# EAGLE board 3piRB (EAGLE 8.0.2), part 1 of 2
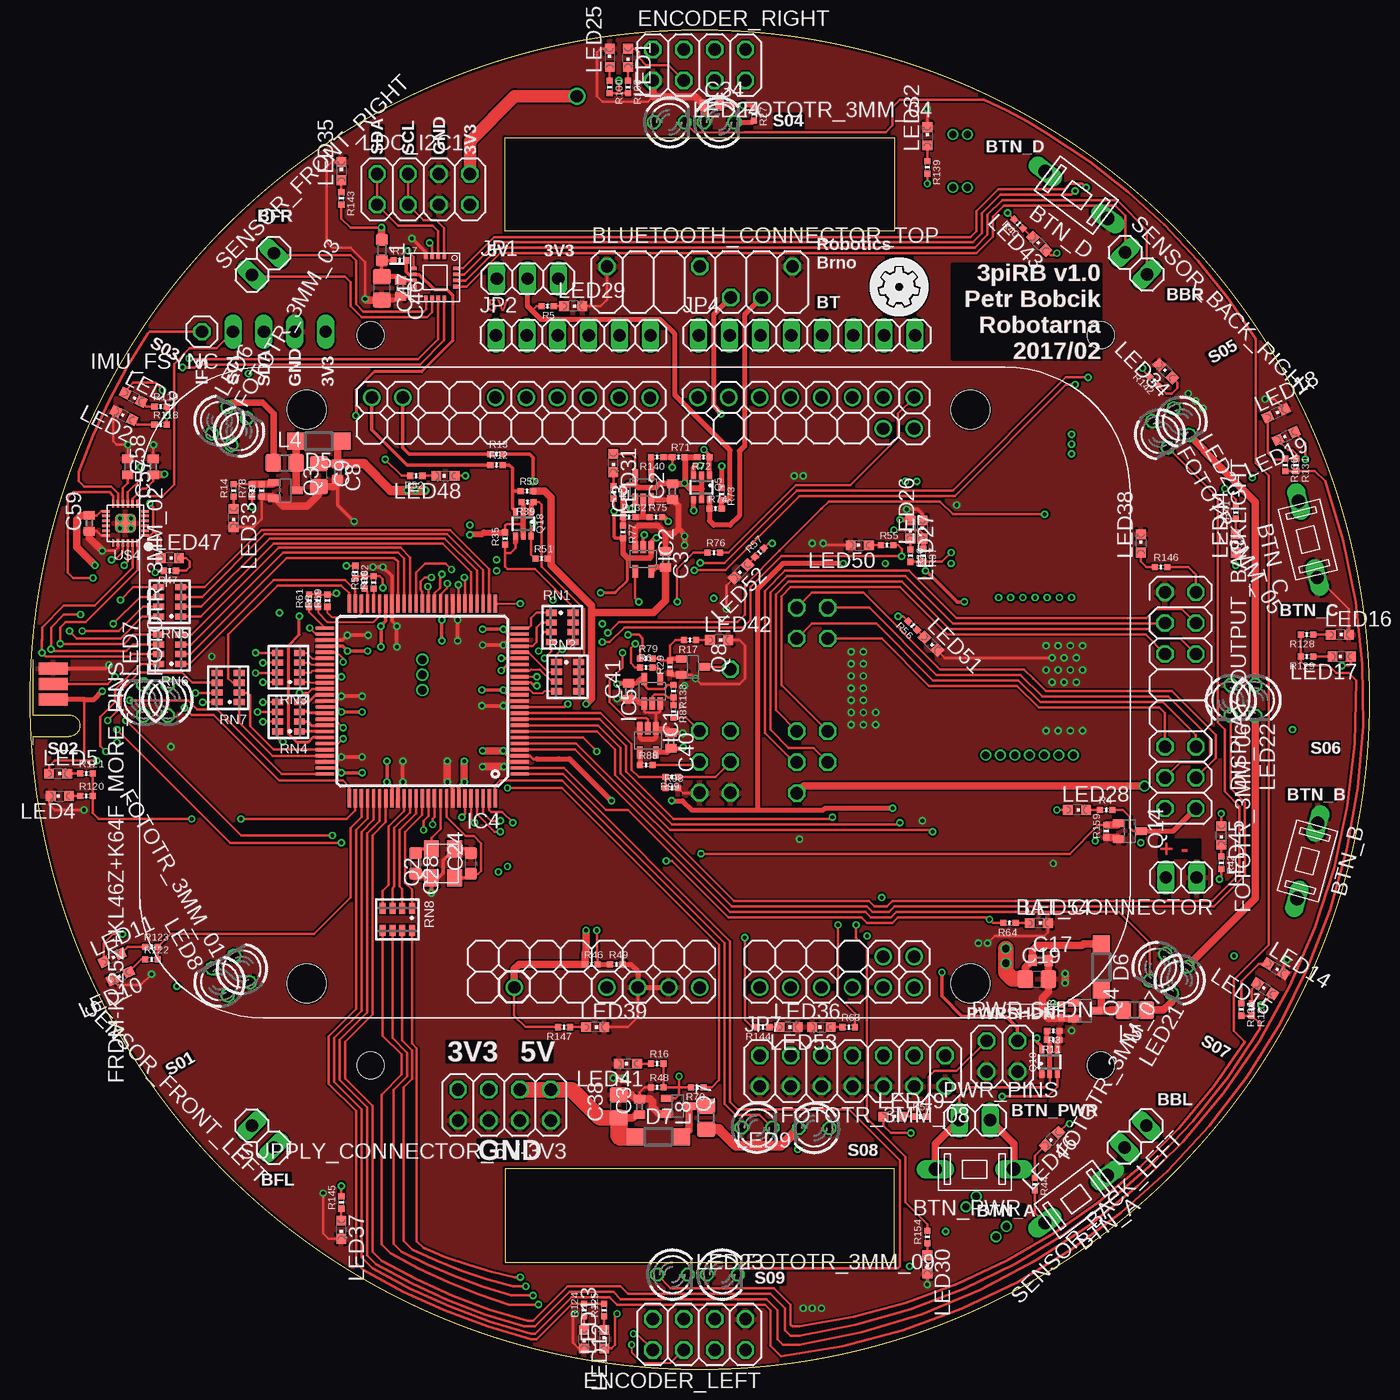
[diagram p13: board, top side]
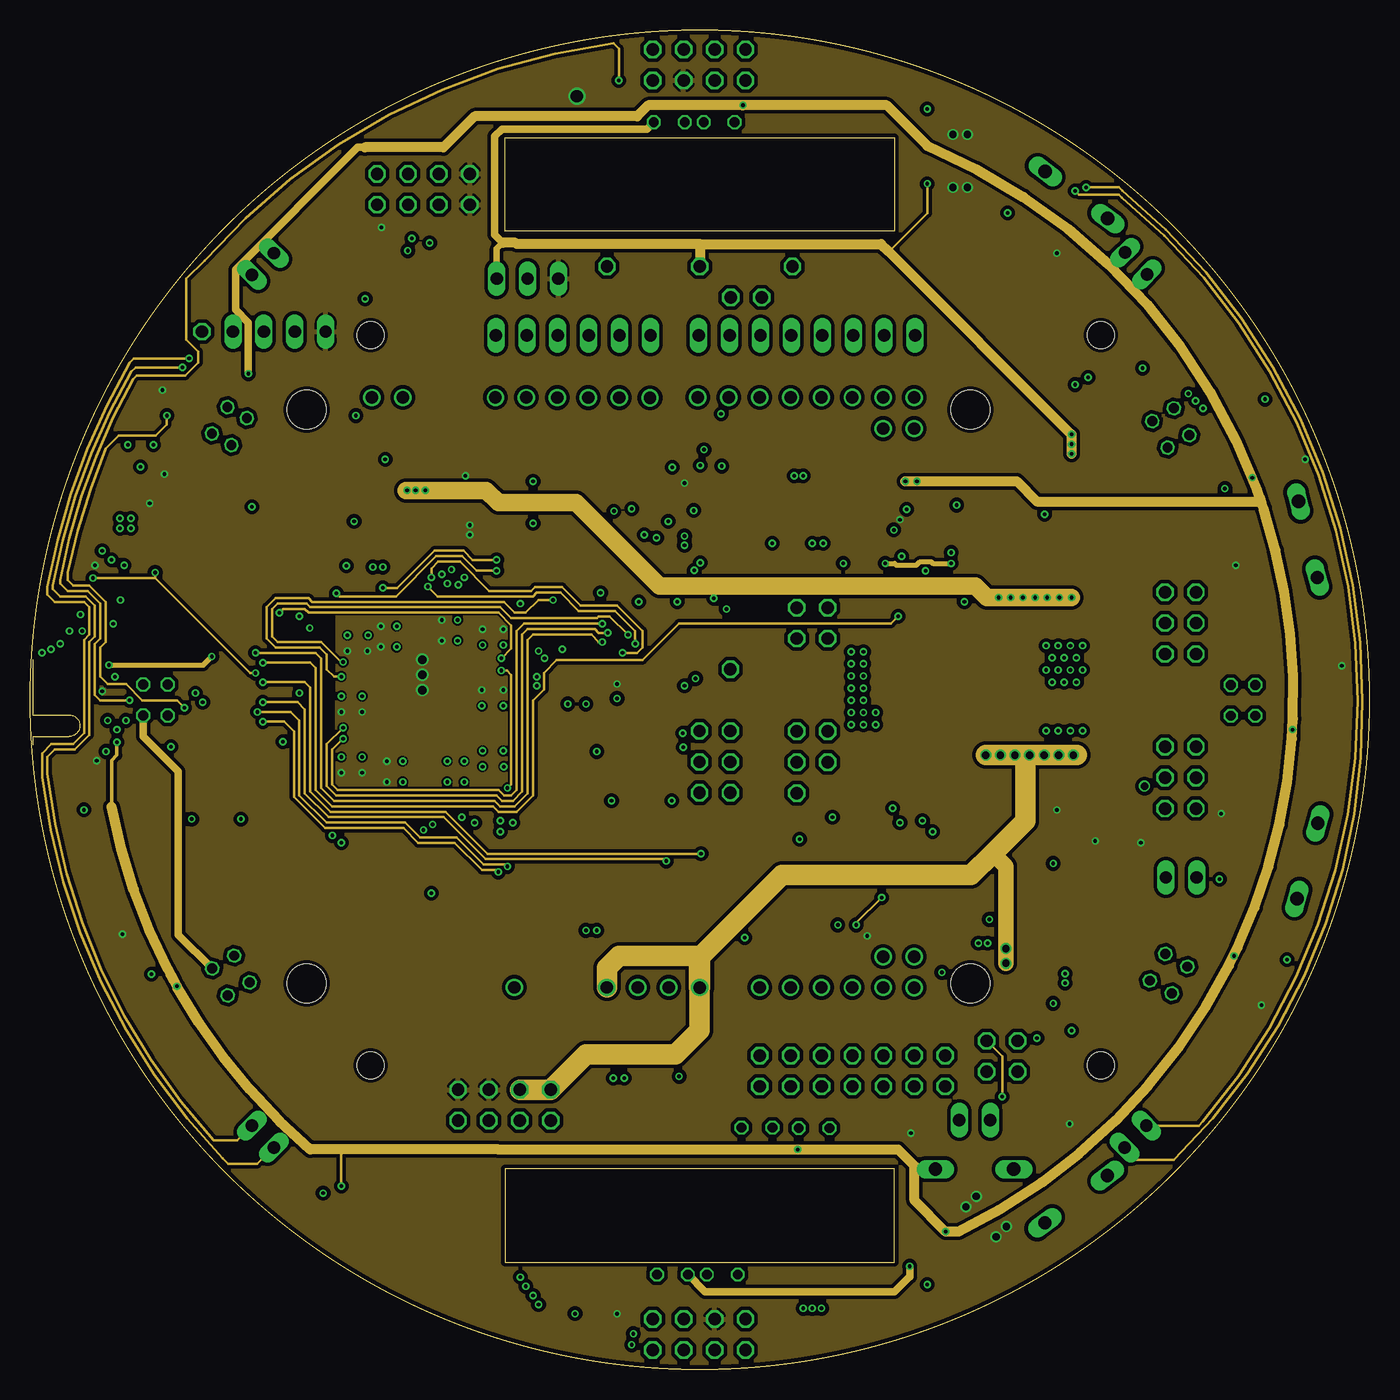
[diagram p14: board, inner layer POWER]
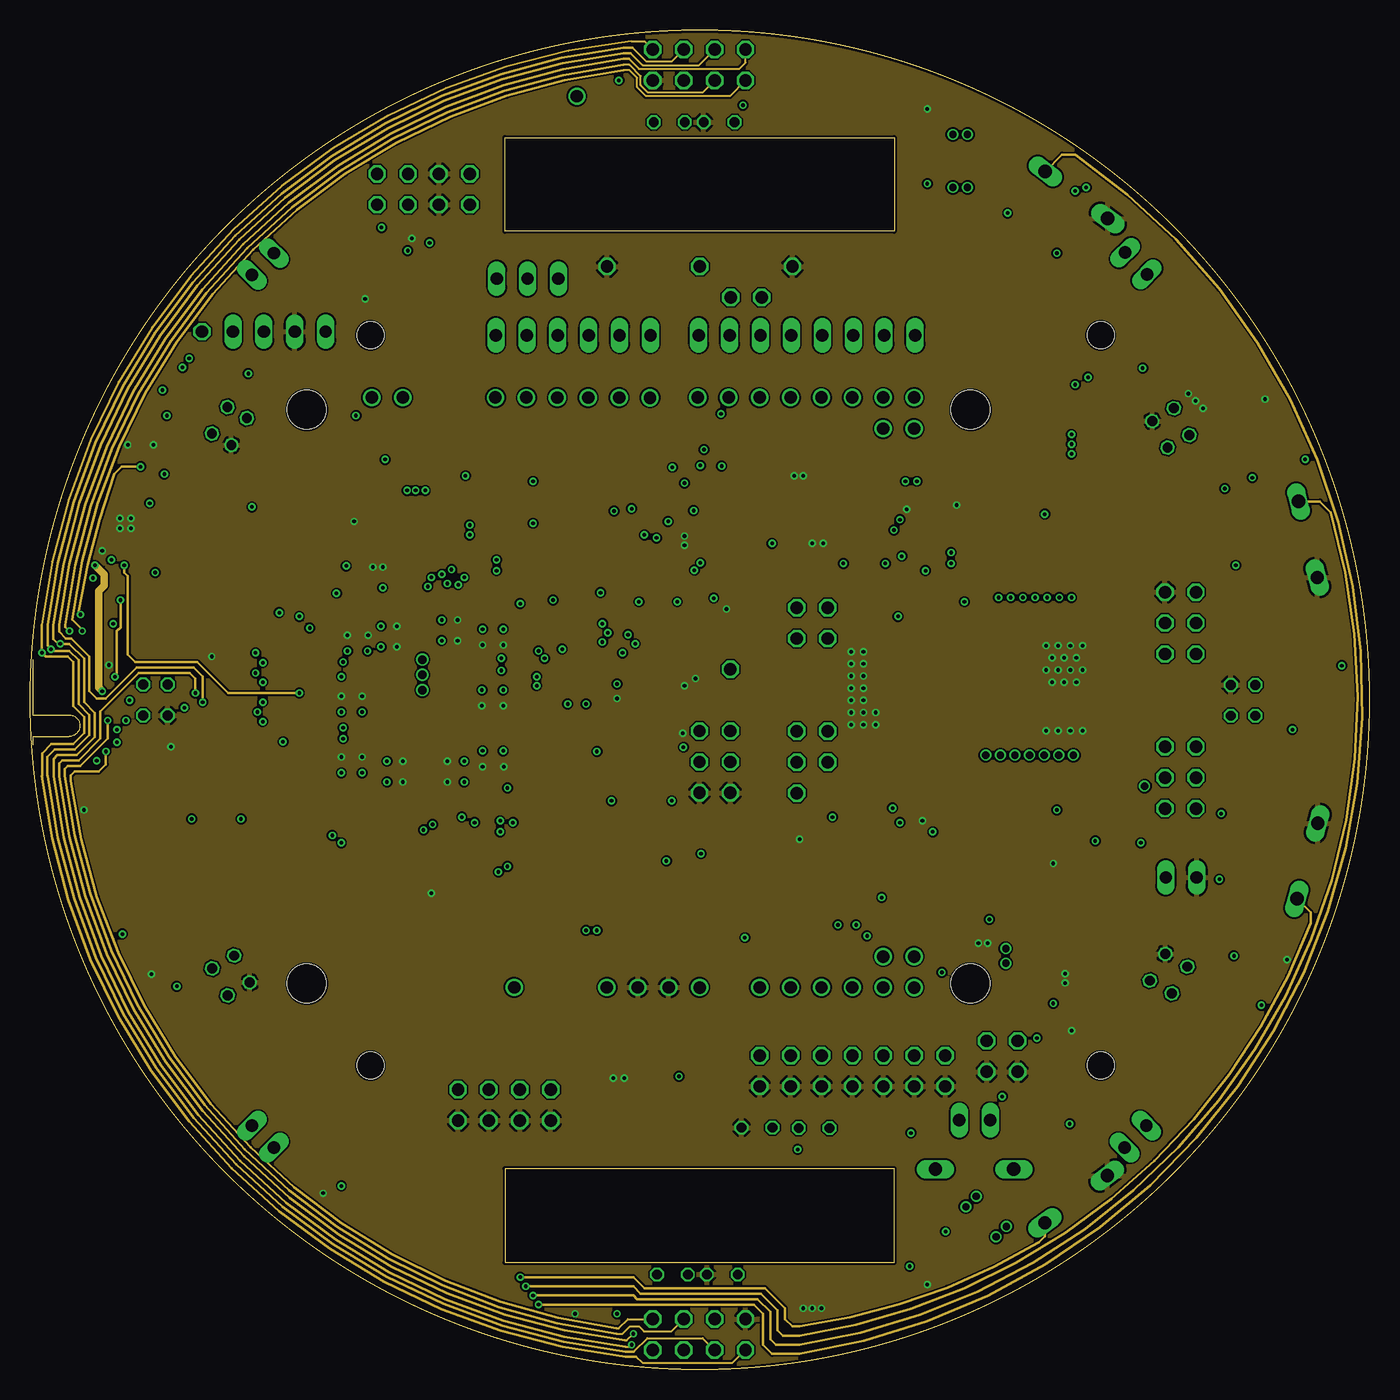
[diagram p15: board, inner layer GND]
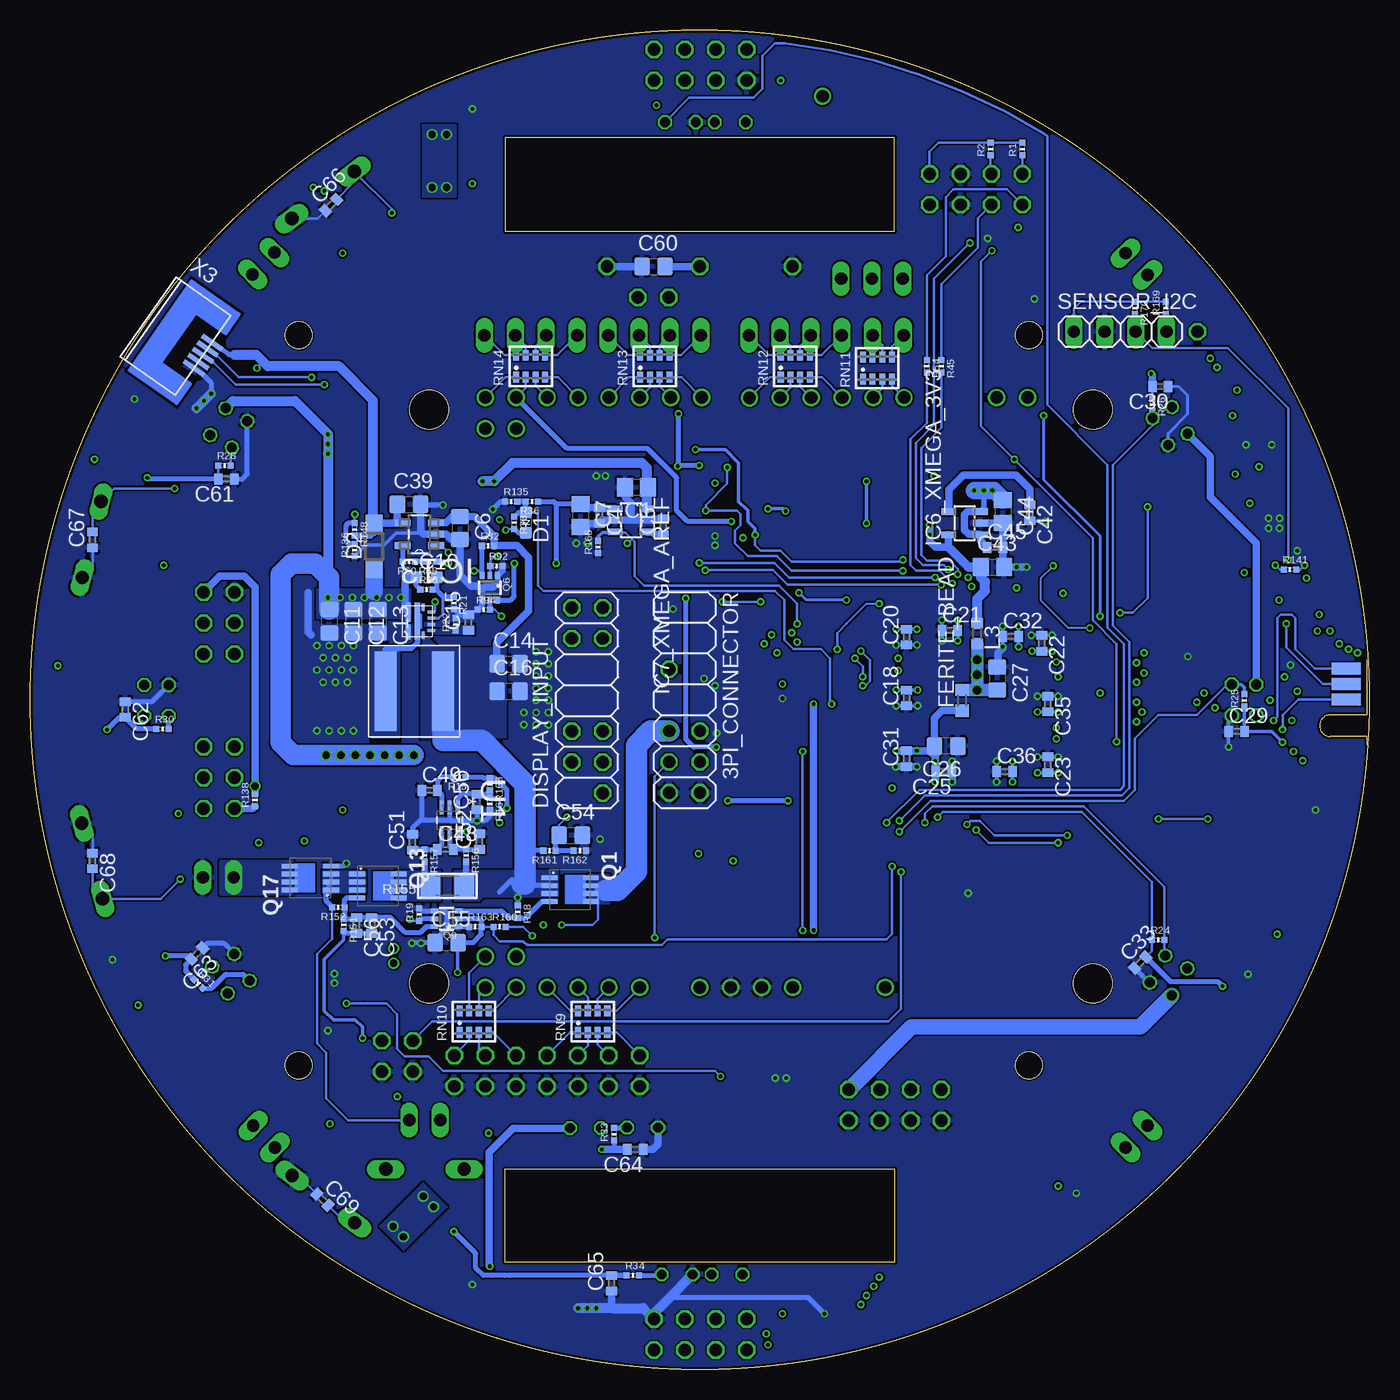
[diagram p16: board, bottom side, seen from below]

Size 110 x 110 mm. Coordinates in mm from the lower left corner, seen from the top.
Outline: 38.99,101.19 70.99,101.19 70.99,93.49 38.99,93.49 38.99,101.19
Outline: 38.99,8.77 70.99,8.77 70.99,16.47 38.99,16.47 38.99,8.77
Outline: circle at 55,55 radius 55
Copper layers (1+2*3+16): Top 0.035mm / dielectric 0.275mm / POWER 0.035mm / dielectric 0.9mm / GND 0.035mm / dielectric 0.275mm / Bot 0.035mm
Design rules "gatema_4_layer": minimum track width 0.15mm, minimum drill 0.3mm, track to track 0.15mm, track to pad 0.15mm, pad to pad 0.15mm, via to via 0.15mm, smd to smd 0mil, copper to edge 0.15mm, drill to drill 0.4mm, minimum pad ring 0.15mm, minimum via ring 0.15mm, stop-mask expansion 0.1mm, vias tented up to drill 0.6mm, thermal gap 0.2mm
Holes 2.2 mm at 27.95,24.95 87.95,24.95 87.95,84.95 27.95,84.95

## Footprints (pad centres in the part's own frame; a part is rotated, then mirrored left to right if it is on the bottom)
3PI_BT_CONNECTOR = drill 1.016 octagon: 6 -2.54,-1.27; 9 2.54,1.27; 10 2.54,-1.27; 11 5.08,1.27; 12 5.08,-1.27; 13 7.62,1.27; 14 7.62,-1.27
1X02 = drill 1.016 long: 1 -1.27,0; 2 1.27,0
BLUETOOTH_CONNECTOR_TOP = drill 1.016 octagon: 2 -7.62,1.27; 8 0,1.27; 9 2.54,-1.27; 11 5.08,-1.27; 14 7.62,1.27
TACTM-35N-F = drill 1.1 long: P$2 3.231,-0.02; P$4 -3.204,-0.02
C0805 = smd 1.3 x 1.5: 1 -0.95,0; 2 0.95,0
C0402 = smd 0.7 x 0.9: 1 -0.65,0; 2 0.65,0
C0603 = smd 1 x 1: 1 -0.85,0; 2 0.85,0
D0603 = smd 1 x 1: A -0.85,0; C 0.85,0
SOD123 = smd 1.4 x 1.4: A 1.9,0; C -1.9,0
DISPLAY_INPUT = drill 1.016 octagon: 2 -7.62,-1.27; 3 -5.08,1.27; 4 -5.08,-1.27; 5 -2.54,1.27; 6 -2.54,-1.27; 11 5.08,1.27; 12 5.08,-1.27; 13 7.62,1.27; 14 7.62,-1.27
PINHEAD_2X8_DISPLAY = drill 1.016 octagon: 1 -8.89,-1.27; 2 -8.89,1.27; 3 -6.35,-1.27; 4 -6.35,1.27; 5 -3.81,-1.27; 6 -3.81,1.27; 11 3.81,-1.27; 12 3.81,1.27; 13 6.35,-1.27; 14 6.35,1.27; 15 8.89,-1.27; 16 8.89,1.27
2X04 = drill 1.016 octagon: 1 -3.81,-1.27; 2 -3.81,1.27; 3 -1.27,-1.27; 4 -1.27,1.27; 5 1.27,-1.27; 6 1.27,1.27; 7 3.81,-1.27; 8 3.81,1.27
R0603 = smd 1 x 1.1: 1 -0.85,0; 2 0.85,0
LED3MM = drill 0.813 octagon: A -1.27,0; K 1.27,0
SOT353 = smd 0.45 x 1: 1 -0.65,-1; 2 0,-1; 3 0.65,-1; 4 0.65,1; 5 -0.65,1
TQFP100 = smd 1.5 x 0.27: 1 -8,6; 2 -8,5.5; 3 -8,5; 4 -8,4.5; 5 -8,4; 6 -8,3.5; 7 -8,3; 8 -8,2.5; 9 -8,2; 10 -8,1.5; 11 -8,1; 12 -8,0.5; 13 -8,0; 14 -8,-0.5; 15 -8,-1; 16 -8,-1.5; 17 -8,-2; 18 -8,-2.5; 19 -8,-3; 20 -8,-3.5; 21 -8,-4; 22 -8,-4.5; 23 -8,-5; 24 -8,-5.5; 25 -8,-6; 51 8,-6; 52 8,-5.5; 53 8,-5; 54 8,-4.5; 55 8,-4; 56 8,-3.5; 57 8,-3; 58 8,-2.5; 59 8,-2; 60 8,-1.5; 61 8,-1; 62 8,-0.5; 63 8,0; 64 8,0.5; 65 8,1; 66 8,1.5; 67 8,2; 68 8,2.5; 69 8,3; 70 8,3.5; 71 8,4; 72 8,4.5; 73 8,5; 74 8,5.5; 75 8,6 | smd 0.27 x 1.5: 26 -6,-8; 27 -5.5,-8; 28 -5,-8; 29 -4.5,-8; 30 -4,-8; 31 -3.5,-8; 32 -3,-8; 33 -2.5,-8; 34 -2,-8; 35 -1.5,-8; 36 -1,-8; 37 -0.5,-8; 38 0,-8; 39 0.5,-8; 40 1,-8; 41 1.5,-8; 42 2,-8; 43 2.5,-8; 44 3,-8; 45 3.5,-8; 46 4,-8; 47 4.5,-8; 48 5,-8; 49 5.5,-8; 50 6,-8; 76 6,8; 77 5.5,8; 78 5,8; 79 4.5,8; 80 4,8; 81 3.5,8; 82 3,8; 83 2.5,8; 84 2,8; 85 1.5,8; 86 1,8; 87 0.5,8; 88 0,8; 89 -0.5,8; 90 -1,8; 91 -1.5,8; 92 -2,8; 93 -2.5,8; 94 -3,8; 95 -3.5,8; 96 -4,8; 97 -4.5,8; 98 -5,8; 99 -5.5,8; 100 -6,8
SOT23-DBV = smd 0.55 x 1.2: 1 -0.95,-1.3; 2 0,-1.3; 3 0.95,-1.3; 4 0.95,1.3; 5 -0.95,1.3
SOT95P300X145-5N = smd 1.321 x 0.559: 1 -1.372,0.94; 2 -1.372,0; 3 -1.372,-0.94; 4 1.372,-0.94; 5 1.372,0.94
1X01 = drill 1.016 octagon: 1 0,0
1X03 = drill 1.016 long: 1 -2.54,0; 2 0,0; 3 2.54,0
1X06 = drill 1.016 long: 1 -6.35,0; 2 -3.81,0; 3 -1.27,0; 4 1.27,0; 5 3.81,0; 6 6.35,0
SMD-6 = smd 2.4 x 1: P$1 1.7,-0.03; P$3 1.7,-1.3; P$5 1.7,-2.57 | smd 2.4 x 1 bottom: P$2 1.7,-0.03; P$4 1.7,-1.3; P$6 1.7,-2.57
1X08 = drill 1.016 long: 1 -8.89,0; 2 -6.35,0; 3 -3.81,0; 4 -1.27,0; 5 1.27,0; 6 3.81,0; 7 6.35,0; 8 8.89,0
2X07 = drill 1.016 octagon: 1 -7.62,-1.27; 2 -7.62,1.27; 3 -5.08,-1.27; 4 -5.08,1.27; 5 -2.54,-1.27; 6 -2.54,1.27; 7 0,-1.27; 8 0,1.27; 9 2.54,-1.27; 10 2.54,1.27; 11 5.08,-1.27; 12 5.08,1.27; 13 7.62,-1.27; 14 7.62,1.27
R0603' = smd 1 x 1: 1 -0.85,0; 2 0.85,0
R0805@1 = smd 1.3 x 1.5: 1 -0.95,0; 2 0.95,0
XAL7030 = smd 1.78 x 6.52: 1 -2.36,0; 2 2.36,0
CHIPLED_0603 = smd 0.8 x 0.8: A 0,-0.75; C 0,0.75
2X02 = drill 1.016 octagon: 1 -1.27,-1.27; 2 -1.27,1.27; 3 1.27,-1.27; 4 1.27,1.27
MLP3.3X3.3_HS = smd 0.4 x 1.3: 1 -0.975,-1.7; 2 -0.325,-1.7; 3 0.325,-1.7; 4 0.975,-1.7; 5 0.975,1.7; 6 0.325,1.7; 7 -0.325,1.7; 8 -0.975,1.7
ABM8 = smd 1.4 x 1.2: GND$1 -1.2,0.95; GND$2 1.2,-0.95; Q$1 -1.2,-0.95; Q$2 1.2,0.95
SOT323 = smd 0.6 x 1: 1 -0.65,-0.9; 2 0.65,-0.9; 3 0,0.9
SOT363 = smd 0.4 x 0.6: 1 -0.65,-1; 2 0,-1; 3 0.65,-1; 4 0.65,1; 5 0,1; 6 -0.65,1
_0402MP = smd 0.5 x 0.5: 1 -0.508,0; 2 0.508,0
1206 = smd 1.6 x 1.8: 1 -1.4,0; 2 1.4,0
742-8 = smd 0.5 x 0.9: 1 -1.2,-0.9; 2 -0.4,-0.9; 3 0.4,-0.9; 4 1.2,-0.9; 5 1.2,0.9; 6 0.4,0.9; 7 -0.4,0.9; 8 -1.2,0.9
1X04 = drill 1.016 long: 1 -3.81,0; 2 -1.27,0; 3 1.27,0; 4 3.81,0
SOT65P210X110-6N = smd 1.168 x 0.356: 1 -1.041,0.66; 2 -1.041,0; 3 -1.041,-0.66; 4 1.041,-0.66; 5 1.041,0; 6 1.041,0.66
VQFN = smd 1.24 x 0.44: 1 -0.9,0.77 | smd 3.04 x 0.44: 2 0,0 | smd 0.6 x 0.25: 3 -1.15,-0.475; 8 1.15,-0.475 | smd 0.25 x 0.6: 4 -0.75,-1.15; 5 -0.25,-1.15; 6 0.25,-1.15; 7 0.75,-1.15 | smd 1.59 x 0.44: 9 0.725,0.77
FRDM-KL25Z+KL46Z+K64F_MORE_PINS = drill 1.016: J1_1 -22.334,21.662; J1_2 -24.885,21.67; J1_3 -22.334,19.122; J1_4 -24.89,19.13; J1_6 -24.89,16.59; J1_8 -24.89,14.05; J1_10 -24.89,11.51; J1_12 -24.89,8.97; J1_14 -24.89,6.43; J1_16 -24.89,3.89; J2_2 -24.87,-0.035; J2_4 -24.875,-2.575; J2_6 -24.88,-5.115; J2_8 -24.88,-7.655; J2_10 -24.885,-10.195; J2_12 -24.885,-12.735; J2_18 -24.885,-20.355; J2_20 -24.885,-22.895; J3_4 23.587,-11.2; J3_10 23.587,-3.58; J3_12 23.59,-1.04; J3_14 23.587,1.5; J3_16 23.592,4.04; J4_2 23.59,8.97; J4_4 23.59,11.51; J4_6 23.59,14.05; J4_8 23.59,16.59; J4_9 21.05,19.13; J4_10 23.59,19.13; J4_11 21.055,21.665; J4_12 23.595,21.67 | hole 3.2: -23.885,26.295; 23.265,26.295; 23.265,-28.245; -23.885,-28.245
LDC1614-WQFN = smd 0.5 x 0.3: 1 0.25,2.75; 2 0.25,2.25; 3 0.25,1.75; 4 0.25,1.25; 9 3.75,1.25; 10 3.75,1.75; 11 3.75,2.25; 12 3.75,2.75 | smd 0.3 x 0.5: 5 1.25,0.25; 6 1.75,0.25; 7 2.25,0.25; 8 2.75,0.25; 13 2.75,3.75; 14 2.25,3.75; 15 1.75,3.75; 16 1.25,3.75
LEAD-QFN24 = smd 0.6 x 0.2: 1 -1.6,1; 2 -1.6,0.6; 3 -1.6,0.2; 4 -1.6,-0.2; 5 -1.6,-0.6; 6 -1.6,-1; 13 1.6,-1; 14 1.6,-0.6; 15 1.6,-0.2; 16 1.6,0.2; 17 1.6,0.6; 18 1.6,1 | smd 0.2 x 0.6: 7 -1,-1.6; 8 -0.6,-1.6; 9 -0.2,-1.6; 10 0.2,-1.6; 11 0.6,-1.6; 12 1,-1.6; 19 1,1.6; 20 0.6,1.6; 21 0.2,1.6; 22 -0.2,1.6; 23 -0.6,1.6; 24 -1,1.6 | smd 1.7 x 1.54: 25 0,0
USB-MICRO-B-BOTTOM-MOLEX = smd 2 x 0.4: 1 5,1.3; 2 5,0.65; 3 5,0; 4 5,-0.65; 5 5,-1.3

## Placement (x,y rotation side)
3PI_CONNECTOR  3PI_CONNECTOR  [3PI_BT_CONNECTOR]  56.25,54.97 270 bottom
BAT_CONNECTOR  BATTERY_LI-POL  [1X02]  94.57,40.4 180 top
BLUETOOTH_CONNECTOR_TOP  [BLUETOOTH_CONNECTOR_TOP]  55,89.33 0 top
BTN_A  TACTM-35N-F  [TACTM-35N-F]  85.95,13.95 217 top
BTN_B  TACTM-35N-F  [TACTM-35N-F]  104.95,41.75 254.5 top
BTN_C  TACTM-35N-F  [TACTM-35N-F]  104.95,68.15 104 top
BTN_D  TACTM-35N-F  [TACTM-35N-F]  85.95,96.45 143 top
BTN_PWR  TACTM-35N-F  [TACTM-35N-F]  77.6,16.4 180 top
C1  10u/16V  [C0805]  60.2,72.45 180 bottom
C2  100n/16V  [C0402]  52.75,72.1 90 top
C3  100n/16V  [C0402]  52.2,66.55 270 top
C4  100n/16V  [C0402]  63.24,70.14 270 bottom
C5  10n/16V  [C0402]  58,69.2 90 bottom
C6  10u/16V  [C0805]  74.7,69.1 270 bottom
C7  10u/16V  [C0805]  64.79,70.14 270 bottom
C8  100n/16V  [C0402]  25.25,73.75 270 top
C9  10u/16V  [C0805]  23.7,73.45 270 top
C10  10p/16V  [C0603]  77.45,65.05 0 bottom
C11  22u/16V  [C0805]  85.45,61.45 270 bottom
C12  22u/16V  [C0805]  83.45,61.45 270 bottom
C13  22u/16V  [C0805]  81.45,61.45 270 bottom
C14  10u/16V  [C0805]  70.7,57.95 0 bottom
C15  10n/16V  [C0402]  74,61.35 90 bottom
C16  1u/16V  [C0805]  70.7,55.7 0 bottom
C17  100n/16V  [C0402]  83,33.6 0 top
C18  100n/16V  [C0402]  38,55.15 90 bottom
C19  10u/16V  [C0805]  82.7,32.05 0 top
C20  100n/16V  [C0402]  38,60.15 90 bottom
C21  100n/16V  [C0402]  34.45,60.7 0 bottom
C22  100n/16V  [C0402]  26.9,59.65 270 bottom
C23  100n/16V  [C0402]  26.4,49.65 270 bottom
C24  10p/16V  [C0603]  36.2,41.55 90 top
C25  100n/16V  [C0402]  34.95,49.1 180 bottom
C26  10u/16V  [C0805]  34.75,51.2 180 bottom
C27  10u/16V  [C0805]  30.55,56.75 270 bottom
C28  10p/16V  [C0603]  31.65,41.55 270 top
C29  100n/16V  [C0402]  10.9,52.4 0 bottom
C30  100n/16V  [C0402]  17.15,80.75 180 bottom
C31  100n/16V  [C0402]  38,50.15 90 bottom
C32  100n/16V  [C0402]  29.45,60.2 0 bottom
C33  100n/16V  [C0402]  18.8,33.4 45 bottom
C34  100n/16V  [C0402]  56,103.85 0 top
C35  100n/16V  [C0402]  26.4,54.65 270 bottom
C36  100n/16V  [C0402]  29.95,49.1 0 bottom
C37  100n/16V  [C0402]  50.05,21.55 90 top
C38  10u/16V  [C0805]  48.35,21.6 90 top
C39  10u/16V  [C0805]  78.9,71.05 0 bottom
C40  100n/16V  [C0402]  52.64,51.66 270 top
C41  100n/16V  [C0402]  49.15,55.7 90 top
C42  10n/16V  [C0402]  27.89,70.36 270 bottom
C43  10u/16V  [C0805]  30.94,65.91 0 bottom
C44  10u/16V  [C0805]  30.09,70.46 270 bottom
C45  100n/16V  [C0402]  30.74,67.51 0 bottom
C46  100n/16V  [C0402]  30.4,88.8 270 top
C47  10u/16V  [C0805]  28.88,88.8 270 top
C48  10n/16V  [C0402]  75.9,42.7 0 bottom
C49  100n/16V  [C0402]  77.2,47.55 0 bottom
C50  100n/16V  [C0402]  73.3,46.6 90 bottom
C51  10n/16V  [C0402]  78.6,43.3 90 bottom
C52  10n/16V  [C0402]  73.1,43.35 90 bottom
C53  100n/16V  [C0402]  81.95,36.45 270 bottom
C54  1u/16V  [C0805]  65.6,43.85 0 bottom
C55  10u/16V  [C0805]  75.8,35.05 0 bottom
C56  100n/16V  [C0402]  83.2,36.45 270 bottom
C57  100n/16V  [C0402]  8,74.15 270 top
C58  100n/16V  [C0402]  10.1,74.15 90 top
C59  100n/16V  [C0402]  4.85,69.5 90 top
C60  10u/16V  [C0805]  58.8,90.6 0 bottom
C61  100n/16V  [C0402]  93.9,73.15 180 bottom
C62  100n/16V  [C0402]  102.2,54.2 270 bottom
C63  100n/16V  [C0402]  96.31,34.14 225 bottom
C64  100n/16V  [C0402]  60.3,18.05 180 bottom
C65  100n/16V  [C0402]  62.25,7.05 90 bottom
C66  100n/16V  [C0402]  85.29,95.64 45 bottom
C67  100n/16V  [C0402]  104.9,68.15 90 bottom
C68  100n/16V  [C0402]  104.9,41.75 270 bottom
C69  100n/16V  [C0402]  86,13.91 315 bottom
D1  [D0603]  69.3,69.55 270 bottom
D2  DB2X41500L  [SOD123]  81.75,67.6 90 bottom
D5  DB2X41500L  [SOD123]  23.7,76.25 180 top
D6  DB2X41500L  [SOD123]  88,33.05 270 top
D7  DB2X41500L  [SOD123]  51.6,19.1 0 top
DISPLAY_INPUT  [DISPLAY_INPUT]  64.25,54.95 90 bottom
DISPLAY_OUTPUT_BACKLIGHT  PINHEAD_2X8_DISPLAY  [PINHEAD_2X8_DISPLAY]  94.5,54.95 270 top
ENCODER_LEFT  [2X04]  54.95,2.84 180 top
ENCODER_RIGHT  [2X04]  54.95,107.16 0 top
FERITE_BEAD  [R0603]  33.45,54.95 90 bottom
FOTOTR_3MM_01  L-93DP3BT  [LED3MM]  17.39,32.87 120 top
FOTOTR_3MM_02  L-93DP3BT  [LED3MM]  11.27,54.98 90 top
FOTOTR_3MM_03  L-93DP3BT  [LED3MM]  17.15,77.04 60 top
FOTOTR_3MM_04  L-93DP3BT  [LED3MM]  56.6,102.45 0 top
FOTOTR_3MM_05  L-93DP3BT  [LED3MM]  92.81,76.81 300 top
FOTOTR_3MM_06  L-93DP3BT  [LED3MM]  98.63,54.96 270 top
FOTOTR_3MM_07  L-93DP3BT  [LED3MM]  92.61,33.02 240 top
FOTOTR_3MM_08  L-93DP3BT  [LED3MM]  59.7,19.84 0 top
FOTOTR_3MM_09  L-93DP3BT  [LED3MM]  56.85,7.77 0 top
IC1  M74VHC1GT125DF2G  [SOT353]  50.74,51.66 180 top
IC2  M74VHC1GT125DF2G  [SOT353]  50.35,66.55 180 top
IC3  M74VHC1GT125DF2G  [SOT353]  50.35,72.45 0 top
IC4  AVR_XMEGA_A1_100A  [TQFP100]  32.2,54.9 180 top
IC5  M74VHC1GT125DF2G  [SOT353]  51.1,55.7 0 top
IC6_XMEGA_3V3  TPS73033DBV  [SOT23-DBV]  33.24,69.51 90 bottom
IC7_XMEGA_AREF  TPS73025DBV  [SOT23-DBV]  60.65,69.75 270 bottom
IC13  MCP73831T-2ATI/OT  [SOT95P300X145-5N]  78.05,68.6 180 bottom
IMU_FSYNC  [1X01]  14.1,85.25 180 top
JP1  BT_COM_VOLTAGE_SETTING  [1X03]  40.85,89.6 0 top
JP2  [1X06]  44.6,84.95 0 top
JP3  CON_PROG-6SMD  [SMD-6]  0.17,55 180 bottom
JP4  [1X08]  63.8,84.95 0 top
JP7  [2X07]  67.55,24.5 0 top
L1  10uH 1463501  [R0603']  28.88,91.95 270 top
L3  10uH 1463501  [R0603']  32.2,60.45 270 bottom
L4  [R0805@1]  20.9,74.45 0 top
L5  [R0805@1]  90.75,29.5 180 top
L8  [R0805@1]  55.55,20.65 90 top
L14  1uH  [XAL7030]  78.45,55.7 180 bottom
LDC_I2C1  [2X04]  32.3,96.95 0 top
LED1  red  [CHIPLED_0603]  49.1,107.75 180 top
LED2  green  [CHIPLED_0603]  7.7,78.35 63 top
LED3  red  [CHIPLED_0603]  8.45,79.85 243 top
LED4  green  [CHIPLED_0603]  2.42,47.09 90 top
LED5  red  [CHIPLED_0603]  2.27,48.93 270 top
LED6  L-934F3C  [LED3MM]  15.55,77.96 60 top
LED7  L-934F3C  [LED3MM]  9.27,54.98 90 top
LED8  L-934F3C  [LED3MM]  15.56,31.82 120 top
LED9  L-934F3C  [LED3MM]  64.4,19.8 180 top
LED10  green  [CHIPLED_0603]  7.4,32.3 115 top
LED11  red  [CHIPLED_0603]  6.71,33.79 295 top
LED12  green  [CHIPLED_0603]  45.5,2.45 180 top
LED13  red  [CHIPLED_0603]  47.15,2.45 0 top
LED14  green  [CHIPLED_0603]  102.35,32.9 238 top
LED15  red  [CHIPLED_0603]  101.45,31.25 57 top
LED16  green  [CHIPLED_0603]  107.6,60.35 270 top
LED17  red  [CHIPLED_0603]  107.75,58.55 90 top
LED18  green  [CHIPLED_0603]  102.37,78.55 295 top
LED19  red  [CHIPLED_0603]  103.19,76.67 115 top
LED20  L-934F3C  [LED3MM]  94.58,77.85 300 top
LED21  L-934F3C  [LED3MM]  94.42,31.97 240 top
LED22  L-934F3C  [LED3MM]  100.65,54.96 270 top
LED23  L-934F3C  [LED3MM]  52.75,7.77 0 top
LED24  L-934F3C  [LED3MM]  52.5,102.45 0 top
LED25  green  [CHIPLED_0603]  47.6,107.75 0 top
LED26  green  [CHIPLED_0603]  73.29,69 0 top
LED27  red  [CHIPLED_0603]  72.32,69.01 180 top
LED28  green  [CHIPLED_0603]  86,45.95 270 top
LED29  green  [CHIPLED_0603]  44.6,87.35 270 top
LED30  green  [CHIPLED_0603]  73.7,8.6 180 top
LED31  green  [CHIPLED_0603]  47.9,74.45 180 top
LED32  green  [CHIPLED_0603]  73.7,101.3 0 top
LED33  green  [CHIPLED_0603]  16.7,69.95 180 top
LED34  green  [CHIPLED_0603]  93.31,81.99 45 top
LED35  green  [CHIPLED_0603]  25.55,98.45 0 top
LED36  green  [CHIPLED_0603]  62.3,28.1 270 top
LED37  green  [CHIPLED_0603]  25.55,11.45 180 top
LED38  green  [CHIPLED_0603]  91.25,67.85 0 top
LED39  green  [CHIPLED_0603]  46.4,28.1 270 top
LED41  green  [CHIPLED_0603]  49.1,25.1 90 top
LED42  green  [CHIPLED_0603]  56.6,59.9 270 top
LED43  green  [CHIPLED_0603]  82.89,92.47 45 top
LED44  green  [CHIPLED_0603]  99.05,67.85 0 top
LED45  green  [CHIPLED_0603]  97.85,43.85 180 top
LED46  green  [CHIPLED_0603]  83.94,18.91 135 top
LED47  green  [CHIPLED_0603]  11.45,66.65 270 top
LED48  green  [CHIPLED_0603]  34.1,73.4 90 top
LED49  green  [CHIPLED_0603]  70.85,20.75 270 top
LED50  green  [CHIPLED_0603]  68.15,67.7 90 top
LED51  green  [CHIPLED_0603]  74,59.6 225 top
LED52  green  [CHIPLED_0603]  58.38,65.56 135 top
LED53  green  [CHIPLED_0603]  65,28.1 90 top
LED54  green  [CHIPLED_0603]  82.85,36.65 270 top
PWR-SHDN  [2X02]  79.85,25.7 0 top
PWR_PINS  [1X02]  77.6,20.45 0 top
Q1  FDMC510P  [MLP3.3X3.3_HS]  65.65,39.4 270 bottom
Q2  16 MHz  [ABM8]  33.9,41.55 90 top
Q3  [SOT323]  20.95,72.2 270 top
Q4  [SOT323]  86.7,29.45 270 top
Q5  NTJD5121NT1G  [SOT363]  55.15,72.45 180 top
Q6  NTJD5121NT1G  [SOT363]  72.25,64.2 180 bottom
Q7  [SOT323]  53.2,21.6 270 top
Q8  [SOT323]  54.45,57.7 270 top
Q9  NTJD5121NT1G  [SOT363]  75.8,37 90 bottom
Q10  NTJD5121NT1G  [SOT363]  83.75,25.25 0 top
Q13  FDMC510P  [MLP3.3X3.3_HS]  81.45,39.7 270 bottom
Q14  [SOT323]  90.35,44.2 270 top
Q17  FDMC510P  [MLP3.3X3.3_HS]  87,40.35 90 bottom
Q18  NTJD5121NT1G  [SOT363]  40.5,69.45 180 top
R1  10k  [_0402MP]  28.5,100.25 90 bottom
R2  10k  [_0402MP]  31.1,100.25 90 bottom
R3  100k  [_0402MP]  84.05,27.8 180 top
R4  1k  [_0402MP]  88.4,45.95 0 top
R5  1k  [_0402MP]  42.5,87.35 180 top
R6  180  [_0402MP]  50.6,57.65 0 top
R7  1k  [_0402MP]  47.9,72.05 270 top
R8  180  [_0402MP]  23.65,63.15 90 top
R9  100k  [_0402MP]  19,72.2 90 top
R10  180  [_0402MP]  28.2,64.65 90 top
R11  100k  [_0402MP]  84.05,27.05 180 top
R12  180  [_0402MP]  38.3,74.3 0 top
R13  180  [_0402MP]  38.3,75.2 0 top
R14  1k  [_0402MP]  16.7,72.2 90 top
R15  1k  [_0402MP]  74.75,48.65 180 bottom
R16  1k  [_0402MP]  51.5,25.1 0 top
R17  1k  [_0402MP]  54.2,59.9 180 top
R18  100k  [_0402MP]  69.95,37.58 270 bottom
R19  100k  [_0402MP]  78.05,37.35 90 bottom
R20  180  [_0402MP]  72.32,66.85 270 top
R21  330k  [_0402MP]  75.2,62.95 270 bottom
R22  44,2k  [_0402MP]  75.05,61.2 90 bottom
R23  1M  [_0402MP]  77.45,64.05 0 bottom
R24  10k  [_0402MP]  17.34,35.26 0 bottom
R25  10k  [_0402MP]  10.25,54.95 90 bottom
R26  10k  [_0402MP]  17.8,79.25 270 bottom
R27  10k  [_0402MP]  59.45,103.1 270 top
R28  10k  [_0402MP]  94.06,74.26 0 bottom
R29  100k  [_0402MP]  52.55,57.7 90 top
R30  10k  [_0402MP]  99.15,52.6 0 bottom
R31  10k  [_0402MP]  96.19,31.65 315 bottom
R32  1M  [_0402MP]  72.4,67.65 0 bottom
R33  10k  [_0402MP]  62.05,19.3 90 bottom
R34  10k  [_0402MP]  60.5,7.7 0 bottom
R35  10k  [_0402MP]  39,68.25 90 top
R36  22k  [_0402MP]  68.8,71.3 180 bottom
R37  330R  [_0402MP]  73.36,66.86 270 top
R38  22k  [_0402MP]  70.25,69.55 270 bottom
R39  10k  [_0402MP]  40.85,71.25 180 top
R40  1k  [_0402MP]  81.2,94.1 135 top
R41  1k  [_0402MP]  99.05,70.4 90 top
R42  1k  [_0402MP]  97.85,41.6 270 top
R43  100k  [_0402MP]  84.7,29.45 90 top
R44  1k  [_0402MP]  82.55,15.2 270 top
R45  180  [_0402MP]  35.15,82.4 270 bottom
R46  10k  [_0402MP]  46.1,33.25 0 top
R47  1k  [_0402MP]  11.45,65.6 180 top
R48  100k  [_0402MP]  51.5,23.15 0 top
R49  22k  [_0402MP]  48.15,33.25 0 top
R50  10k  [_0402MP]  40.8,72.15 0 top
R51  10k  [_0402MP]  42,66.6 0 top
R52  1k  [_0402MP]  31.7,73.4 180 top
R53  1k  [_0402MP]  73.1,20.75 0 top
R54  180  [_0402MP]  36.35,82.4 270 bottom
R55  1k  [_0402MP]  70.4,67.7 0 top
R56  1k  [_0402MP]  72.5,61.1 135 top
R57  1k  [_0402MP]  59.9,67.1 45 top
R58  180  [_0402MP]  27.45,64.65 90 top
R59  180  [_0402MP]  24.4,63.15 90 top
R60  1k  [_0402MP]  78.9,66.35 180 bottom
R61  180  [_0402MP]  22.9,63.15 90 top
R62  180  [_0402MP]  26.7,65.5 270 top
R63  1k  [_0402MP]  67.25,28.1 0 top
R64  1k  [_0402MP]  80.45,36.65 180 top
R65  1k  [_0402MP]  77.15,66.35 180 bottom
R70  180  [_0402MP]  54.8,23.15 180 top
R71  10k  [_0402MP]  53.25,74.95 0 top
R72  10k  [_0402MP]  55.3,74.95 180 top
R73  10k  [_0402MP]  56.8,71.9 270 top
R74  10k  [_0402MP]  56.3,70.7 0 top
R75  10k  [_0402MP]  51.4,70 0 top
R76  1k  [_0402MP]  56.15,67.1 0 top
R77  100k  [_0402MP]  48.7,68.8 270 top
R78  180  [_0402MP]  18.2,72.2 90 top
R79  180  [_0402MP]  50.6,58.4 0 top
R87  10k  [_0402MP]  52.85,54.05 270 top
R88  1k  [_0402MP]  50.61,49.63 0 top
R92  100k  [_0402MP]  71.7,66 0 bottom
R94  100k  [_0402MP]  72.75,62.4 0 bottom
R98  10k  [_0402MP]  52.7,47.75 0 top
R99  44,2k  [_0402MP]  52.7,48.65 180 top
R100  150  [_0402MP]  47.6,105.35 270 top
R108  180  [_0402MP]  49.1,105.35 270 top
R117  100k  [_0402MP]  30.35,91.1 0 top
R118  150  [_0402MP]  10.7,77.6 0 top
R119  180  [_0402MP]  10.7,79.1 0 top
R120  150  [_0402MP]  4.6,47.09 0 top
R121  180  [_0402MP]  4.6,48.93 0 top
R122  150  [_0402MP]  9.95,33.65 0 top
R123  180  [_0402MP]  9.95,34.7 0 top
R124  150  [_0402MP]  45.5,4.85 90 top
R125  180  [_0402MP]  47.15,4.85 90 top
R126  150  [_0402MP]  99.5,29.55 270 top
R127  180  [_0402MP]  100.35,29.55 270 top
R128  150  [_0402MP]  104.9,60.35 180 top
R129  180  [_0402MP]  104.9,58.55 180 top
R130  150  [_0402MP]  103.1,74.3 270 top
R131  180  [_0402MP]  104,74.3 270 top
R132  100k  [_0402MP]  49.2,70 0 top
R133  100k  [_0402MP]  52.85,55.7 270 top
R135  10k  [_0402MP]  70.5,71.3 0 bottom
R136  22k  [_0402MP]  83.35,67.3 90 bottom
R138  180  [_0402MP]  91.55,46.75 90 bottom
R139  1k  [_0402MP]  73.7,98.75 270 top
R140  180  [_0402MP]  51.5,74.95 180 top
R141  100k  [_0402MP]  6.5,65.7 0 bottom
R142  1k  [_0402MP]  92.3,81.2 135 top
R143  1k  [_0402MP]  25.55,96.2 270 top
R144  1k  [_0402MP]  60.2,28.1 180 top
R145  1k  [_0402MP]  25.55,13.7 90 top
R146  1k  [_0402MP]  92.9,65.9 0 top
R147  1k  [_0402MP]  43.85,28.1 180 top
R148  10k  [_0402MP]  83.35,69 270 bottom
R151  1M  [_0402MP]  84.25,36.5 270 bottom
R152  100k  [_0402MP]  84.7,37.95 180 bottom
R154  1k  [_0402MP]  73.7,10.85 90 top
R155  1m  [1206]  75.75,39.7 180 bottom
R156  1R  [_0402MP]  74.2,42.2 270 bottom
R157  1R  [_0402MP]  77.6,42.2 270 bottom
R159  100k  [_0402MP]  88.4,44.2 90 top
R160  100k  [_0402MP]  71.45,36.35 0 bottom
R161  22k  [_0402MP]  67.35,42.6 180 bottom
R162  10k  [_0402MP]  64.85,42.6 180 bottom
R163  1M  [_0402MP]  73.45,36.35 0 bottom
R165  1M  [_0402MP]  63.35,67.55 90 bottom
R166  100k  [_0402MP]  72.25,48.05 270 bottom
R167  10k  [_0402MP]  72.25,46.45 270 bottom
R169  10k  [_0402MP]  16.7,87.2 90 bottom
R170  10k  [_0402MP]  19.25,87.2 270 bottom
RN1  180  [742-8]  43.7,60.95 270 top
RN2  180R  [742-8]  44.15,56.9 270 top
RN3  180  [742-8]  21.2,57.65 90 top
RN4  180  [742-8]  21.2,53.6 90 top
RN5  180  [742-8]  11.45,63.05 90 top
RN6  180  [742-8]  11.45,59.15 90 top
RN7  180  [742-8]  16.25,56 90 top
RN8  180  [742-8]  30.15,36.95 180 top
RN9  180R  [742-8]  63.8,28.55 0 bottom
RN10  180R  [742-8]  73.55,28.55 0 bottom
RN11  180R  [742-8]  40.4,82.25 0 bottom
RN12  180R  [742-8]  47.15,82.4 0 bottom
RN13  180R  [742-8]  58.7,82.4 0 bottom
RN14  180R  [742-8]  68.9,82.4 0 bottom
SENSOR_BACK_LEFT  BUMPER_COIL  [1X02]  90.8,19.1 225 top
SENSOR_BACK_RIGHT  BUMPER_COIL  [1X02]  90.85,90.85 315 top
SENSOR_FRONT_LEFT  BUMPER_COIL  [1X02]  19.1,19.1 135 top
SENSOR_FRONT_RIGHT  BUMPER_COIL  [1X02]  19.1,90.8 45 top
SENSOR_I2C  [1X04]  20.45,85.25 0 bottom
SUPPLY_CONNECTOR_5V-3V3  [2X04]  38.95,21.69 180 top
U1  INA210AIDCKT  [SOT65P210X110-6N]  75.55,45.1 270 bottom
U5_STEP-UP  TPS61236  [VQFN]  78.2,61.45 90 bottom
U$1  FRDM-KL25Z+KL46Z+K64F_MORE_PINS  [FRDM-KL25Z+KL46Z+K64F_MORE_PINS]  50.95,54.95 270 top
U$3  LDC1614-WQFN  [LDC1614-WQFN]  31.25,91.7 270 top
U$4  MPU-9250  [LEAD-QFN24]  7.8,69.5 180 top
X3  USB-MICRO-B-BOTTOM  [USB-MICRO-B-BOTTOM-MOLEX]  99.92,86.17 325 bottom

## Tracks (layer width: path | path; a pad name or v marks a point on that pad's centre or on a via)
3_PI_POWER_H_GATE
  Bot 0.406: Q1.4 67.98,38.43 69.33,37.07 R18.2 70.72,37.07 71.3,37.65 Q9.3
3PI-POWER
  Top 0.15: RN3.4 22.7,58.85 23.15,58.4 IC4.56
3PI_POWER  (via drill 0.3)
  Top 0.2: RN4.5 19.25,54.8 v19.1,54.8 | v52.25,41.75 52.7,41.75 57.35,37.1 68.3,37.1 68.75,36.65 70.85,36.65 71.3,37.1 78.65,37.1 v78.8,36.95 79.1,36.65 R64.2
  POWER 0.2: v52.25,41.75 52.1,41.9 39.5,41.9 37.4,41.9 33.95,45.35 24.5,45.35 22.55,47.3 22.55,54.2 21.95,54.8 v19.1,54.8
  Bot 0.2: R19.1 78.69,36.84 v78.8,36.95
  Bot 0.4: 77.89,37 R19.1
  Bot 0.406: Q9.5 77.89,37
3PI_RESET
  Top 0.2: R79.2 51.65,58.4 51.84,58.21 R29.2 52.55,59.45 53,59.9 R17.2
  Top 0.406: Q8.1 52.69,58.35 R29.2
3PI_RESET_  (via drill 0.3)
  Top 0.2: IC4.55 25.2,58.9 25.7,58.4 v25.7,58.1 | R79.1 50.09,59.09 50.3,59.3 50.3,60.05 50,60.35 v49.1,60.35
  POWER 0.2: v25.7,58.1 25.55,58.1 23.9,59.75 20.3,59.75 19.85,60.2 19.85,62.45 20.3,62.9 22.7,62.9 23,62.6 38.6,62.6 39.5,61.7 46.55,61.7 46.7,61.85 47.6,61.85 v49.1,60.35
3PI_RESET_ON_CON
  Top 0.2: Q8.3 57.33,57.7 3PI_CONNECTOR.6
3PI_VBAT  (via drill 0.3)
  Top 0.2: R63.2 67.76,29.24 66.35,30.65 v66.35,36.5
  Bot 0.2: v66.35,36.5 63.8,36.5 63.35,36.95 63.35,38.75 62.75,39.35
  Bot 1.778: 62.75,39.35 61.75,39.35 60.2,40.9 60.2,51.26 59.03,52.43 3PI_CONNECTOR.10
  pour Bot (no thermals): 62.45,40.55 66.05,40.55 66.05,38.3 62.45,38.3
3PI_VBST  (via drill 0.3)
  Top 0.2: R99.1 56.28,48.65 3PI_CONNECTOR.12 | R144.2 59.3,28.1 58.7,28.7 v58.7,35.45
  Bot 0.2: v58.7,35.45 58.7,36.8 58.7,46.55 58.7,48.71 3PI_CONNECTOR.12
3PI_VBST_VOLTAGE
  Top 0.2: R98.1 R99.2 50,48.65 49.4,49.25 49.4,51.35 46.85,53.9 IC4.11
3PI_VCC_5V  (via drill 0.6)
  Top 0.2: R146.2 95.15,65.9 95.6,65.45 95.77,65.28 DISPLAY_OUTPUT_BACKLIGHT.2
  Top 0.61: DISPLAY_INPUT.2 63.55,47.9 v91.55,47.9
  Bot 0.61: DISPLAY_OUTPUT_BACKLIGHT.2 94.46,65.15 92.45,65.15 91.55,64.25 v91.55,47.9 R138.2
3V3-L3-VCC_XMEGA  (via drill 0.3, 0.7)
  Top 0.305: IC4.14 39.25,55.4 v38.85,55.8 v37.1,55.8 | IC4.24 39.25,60.4 v38.85,60.8 v37.15,60.8 | IC4.34 34.2,61.95 v33.8,61.55 v33.8,59.85 | IC4.44 29.2,61.45 v28.8,61.05 v28.8,59.35 | IC4.54 25.65,59.4 v26.05,59 v27.7,59 | IC4.64 25.15,54.4 v25.55,54 v27.25,54 | IC4.74 25.15,49.4 v25.55,49 v27.25,49 | IC4.83 29.7,47.85 v29.3,48.25 v29.3,49.95
  Bot 0.305: v28.8,59.35 C32.2 v28.8,61.05 | v27.7,59 C22.2 v26.05,59 | v27.25,54 C35.2 v25.55,54 | v27.25,49 C23.2 v25.55,49 | v37.1,55.8 C18.2 v38.85,55.8 | v37.15,60.8 C20.2 v38.85,60.8 | v33.8,59.85 C21.2 v33.8,61.55 | v29.3,49.95 C36.2 v29.3,48.25
  Bot 1.016: L3.2 v32.2,57.05 v32.2,55.8 | v32.2,55.8 FERITE_BEAD.2 | v32.2,55.8 C27.2
  other vias: 32.2,58.3
  pour POWER: 25.15,47.95 39.1,48 39.1,61.95 25.2,61.95
!SHDN  (via drill 0.3)
  Top 0.2: RN4.6 v18.65,54
  Top 0.305: PWR-SHDN.4 81.12,28.03 80.15,29 76.55,29 74.9,30.65 v74.9,32.6
  POWER 0.2: v18.65,54 21.4,54 22.1,53.3 22.1,47.15 24.35,44.9 30.8,44.9 32,43.7 35,43.7 37.25,41.45 39.05,41.45 v39.2,41.3
  Bot 0.2: R163.2 R160.1 71.96,35.66 71.45,35.15 69.5,35.15 69.2,34.85 58.1,34.85 57.65,35.3 39.65,35.3 39.2,35.75 v39.2,41.3
  Bot 0.305: v74.9,32.6 74.9,35 C55.2
  Bot 0.406: R163.2 arc-90 R163.2 | R163.2 72.94,36.74 arc-90 73.2,37 Q9.2 | 74.44,35.46 arc90 C55.2 73.6,35.05 72.95,35.7 R163.2
+3V3  (via drill 0.3, 0.6, 1)
  Top 0.2: IC5.5 50.45,56.2 50.75,55.9 52.05,55.9 52.36,56.21 R133.1 | R35.2 39,69.3 39.15,69.45 40.5,69.45 | U$4.13 5.8,70.5 5.45,70.15 C59.2 | U$4.8 8.4,71.55 9.2,72.35 9.5,72.35 10.1,72.95 C58.1 | v5.45,50 4.4,50 | 4.4,50 2,50 1.55,49.55 1.55,48.96 LED5.A | v10.85,80.45 10.25,81.05 8.45,81.05 7.78,80.38 LED3.A | LED1.A 49.7,108.5 50,108.2 50,107.75 50.6,107.15 52.42,107.15 ENCODER_RIGHT.3 | LED13.A 47.75,1.7 48.05,2 48.05,4.4 v48.2,4.55 | LED17.A 108.5,57.95 108.35,57.8 v107.75,57.8 | LED15.A v101.15,29.9 | LED19.A 104.75,76.11 v104.75,74.75 | v7.55,35.75 6.8,35.75 6.03,34.98 LED11.A | U$4.1 9.85,68.5 10.1,68.75 10.1,68.9 | 10.1,68.9 10.1,70.85 v9.8,71.15 | 2,54.9 JP3.P$2 | 4.4,50 4.4,55.03 | LED44.A v99.05,66.05 | LED45.A v97.85,45.65 | LED46.A 85.19,20.15 v85.4,20.15 | LED48.A v35.75,73.4 | LED47.A 10.7,68.3 10.1,68.9 | LED31.A 49.4,75.2 49.7,74.9 IC3.5 | LED28.A v84.35,45.95 | R143.2 25.55,94.55 26.3,93.8 v28.85,93.8 | LED49.A 70.1,20 70.7,19.4 v72.35,19.4 | v84.35,91.7 84.2,91.55 83.81,91.55 LED43.A
  Top 0.4: LED27.A 71.5,69.75 v71.45,69.8 | v48.2,56.3 48.25,56.35 C41.2 49.75,56.35 50.1,56.7 IC5.5
  Top 0.406: Q18.2 40.5,71.04 40.34,71.2 R39.2 | R132.1 R77.1 | Q5.2 55.15,72.35 Q5.5 | JP3.P$2 4.4,55.03 5.23,55.03 v5.9,55.7
  Top 0.45: Q18.2 40.5,69.45 Q18.5 | C2.2 51.7,72.75 51.4,72.45 49.95,72.45 49.7,72.7 | R71.2 53.8,74.91 | R132.1 48.69,72.29 49.1,72.7 49.7,72.7 | 49.7,72.7 IC3.5
  Top 0.5: R71.2 R72.2 | 53.8,74.91 53.8,72.85 v53.75,72.8 | 55.15,72.35 54.2,72.35 v53.75,72.8 | v36.1,68.55 36.15,68.6 37.1,68.6 37.26,68.76 R35.2 | C2.2 53.7,72.75 v53.75,72.8
  Top 0.61: C59.2 4.15,70.15 3.8,69.8 3.8,67.55 v5.3,66.05 | C58.1 10.95,73.5 v11,73.55 | L1.1 28.88,93.78 v28.85,93.8
  Top 1.016: LDC_I2C1.8 36.11,100.91 39.8,104.6 v44.9,104.6
  GND 0.61: v5.9,55.7 5.6,56 5.6,63.95 6.05,64.4 6.05,65.3 v5.3,66.05
  Bot 0.2: R1.2 R2.2 35.39,100.76 36.11,100.04 LDC_I2C1.8 | R169.2 R170.1 23.69,87.71 24.26,87.14 SENSOR_I2C.1 | R141.2 5.65,65.7 v5.3,66.05 | R160.2 69.5,36.35 v68.75,35.6
  Bot 0.61: IC6_XMEGA_3V3.5 34.55,67.55 35.65,67.55 36.1,68 v36.1,68.55 v36.1,69.35
  Bot 0.8: 34.55,67.55 32.91,65.91 C43.1
  Bot 0.813: L3.1 32.2,63.3 31.55,63.95 31.55,64.7 31.89,65.04 C43.1
  other vias: 87.5,43.4 91.25,43.25 75.8,97.1 77,97.1 75.8,101.45 77,101.45 77.72,14.19 76.87,13.34 80.2,11.71 79.35,10.87
  pour POWER (isolate 0.3, rank 2): 109.99,54.84 arc-180 -0.11,54.84 arc-180
  pour Bot: 75.05,102.2 77.75,102.2 77.75,96.35 75.05,96.35
  pour Bot: 81.26,11.71 79.35,9.8 75.81,13.34 77.72,15.25
+5V  (via drill 0.3, 0.6)
  Top 0.2: R139.2 v73.7,97.4
  Top 0.4: C40.2 53.55,51.01 v53.65,51.1
  Top 0.406: C40.2 52.29,50.66 IC1.5
  Top 0.61: C9.1 C8.1 25.25,75.9 D5.C | C37.1 49.75,20.9 49.5,20.65 C38.1 | C19.1 81.75,33 C17.1 82.35,34.4 82.75,34.8 86.4,34.8 86.55,34.95 D6.C
  Top 0.8: C8.1 27.4,74.4 29.6,72.2 v32.45,72.2
  Top 1.27: C38.1 46.8,20.65 44.49,22.96 SUPPLY_CONNECTOR_5V-3V3.3 | C19.1 80.7,32.05 80.15,32.6 v80.15,34.55
  Top 1.422: D7.C 48.45,19.1 48.35,19.2 C38.1
  POWER 0.2: v73.7,97.4 73.7,95 70.53,91.83
  POWER 0.4: v56.15,63.35 56.15,64.35
  POWER 0.55: JP1.1 38.31,92.06 38.8,92.55
  POWER 0.61: 38.8,92.55 38.15,93.2 38.15,101.3 38.75,101.9 50.68,101.9 LED24.A
  POWER 0.813: v85.55,75.2 v85.55,76 v85.55,76.8 70.53,91.83 69.9,92.45 55,92.45 | 55,92.45 39.95,92.45 39.85,92.55 38.8,92.55 | 55,92.45 BLUETOOTH_CONNECTOR_TOP.8
  POWER 1.27: v80.15,33.35 v80.15,34.55 80.15,41.31 79.09,42.38 79.08,42.38
  POWER 1.422: v85.55,63.4 v81.55,63.4 78.61,63.4 77.66,64.35 56.15,64.35 51.7,64.35 44.85,71.2 38.45,71.2 37.45,72.2 v32.45,72.2 v31.65,72.2 30.85,72.2
  POWER 1.676: v80.9,50.45 81.45,50.45 81.75,50.15 81.75,45.05 79.08,42.38 77.3,40.6 61.75,40.6 54.99,33.84 54.99,33.8 54.84,33.95 48.35,33.95 47.37,32.97 U$1.J3_10 | v78.5,50.45 v79.7,50.45 v80.9,50.45 | v80.9,50.45 v82.1,50.45 v83.3,50.45 v84.5,50.45 v85.7,50.45 86,50.45 | SUPPLY_CONNECTOR_5V-3V3.3 SUPPLY_CONNECTOR_5V-3V3.1 45.65,25.85 53,25.85 54.99,27.84 U$1.J3_16
  POWER 1.778: 54.99,33.8 U$1.J3_16
  Bot 0.4: v53.65,51.1 55.5,51.1 56.15,51.75 v56.15,63.35
  Bot 0.406: R23.1 78.3,64.39 C10.1
  Bot 0.45: IC6_XMEGA_3V3.3 31.65,70.75 v31.65,72.2
  Bot 0.55: U5_STEP-UP.9 79.2,62.41
  Bot 0.61: C45.1 31.94,68.06 IC6_XMEGA_3V3.1 | IC6_XMEGA_3V3.3 | IC6_XMEGA_3V3.1 | 79.2,62.41 79.2,64.8 78.95,65.05 C10.1 | IC6_XMEGA_3V3.1 31.98,68.6 32.9,68.6 33.25,68.95 33.25,70.2 32.99,70.46 IC6_XMEGA_3V3.3 | C60.2 BLUETOOTH_CONNECTOR_TOP.8
  Bot 0.813: v85.55,63.4 v85.55,75.2 85.55,76.85 88.25,79.55 93.34,79.55 LED20.A
  Bot 1.27: LED8.A 18.82,28.1 37.62,28.1 SUPPLY_CONNECTOR_5V-3V3.1
  Bot 1.4: 30.05,71.45 30.8,72.2 v30.95,72.2
  Bot 1.422: D2.C 81.75,63.9 | C44.1 30.05,71.45 | 30.88,72.2 v30.95,72.2 v31.65,72.2 v32.45,72.2
  Bot 1.676: C11.1 85.45,65.05 86.6,66.2 88.55,66.2 89.45,65.3 89.45,51.5 88.4,50.45 v85.7,50.45 v84.5,50.45 v83.3,50.45 v82.1,50.45 v80.9,50.45 v79.7,50.45 v78.5,50.45
  other vias: 80.55,63.4 82.55,63.4 83.55,63.4 84.55,63.4 79.55,63.4
  pour Bot (no thermals): 78.8,61.45 79.45,61.45 79.45,61.7 86.45,61.7 86.45,64.05 78.8,64.05
AREF  (via drill 0.3)
  Top 0.2: IC4.95 35.7,45.6 v35.45,45.35 | R145.2 v25.55,15.05
  Top 0.406: C34.2 v58.55,103.85 59.21,103.85 R27.1
  POWER 0.2: v103.7,52.55 103.7,53.39 103.74,53.43 | v98.9,33.95 99.19,34.24 99.19,34.63 | v100.4,73.25 100.4,72.55 100.8,72.16 | 101,71.3 101,70.95 101.33,70.62 | v25.55,15.05 25.55,18.05
  POWER 0.305: 6.67,46.23 6.67,50.02 7.1,50.45 v7.1,51.5
  POWER 0.6: 17.9,83.3 17.9,86 16.85,87.05 16.85,90.35 26.9,100.4 27.5,100.4
  POWER 0.61: 17.9,83.3 v17.9,81.8
  POWER 0.813: v71.9,72.95 v72.85,72.95 81.05,72.95 82.7,71.3 101,71.3 | 27.5,100.4 33.95,100.4 36.5,102.95 49.85,102.95 50.75,103.85 v58.55,103.85 70.36,103.85 73.7,100.51 arc-47 100.8,72.16 arc-2 101.33,70.62 arc-20 103.74,53.43 103.65,51.81 arc-21 99.19,34.63 98.48,33.17 arc-37 76.23,11.29 75.21,11.29 v75.2,11.3 72.65,13.85 72.65,16.7 71.3,18.05 v63.05,18.05 38.45,18.05 25.55,18.05 23,18.05 arc-20 v12.04,31.45 arc-2 11.27,32.88 arc-17 6.67,46.23
  Bot 0.2: 103.65,52.6 v103.7,52.55 | C33.2 17.84,34.36 R24.1 17.84,40.04 23.6,45.8 35,45.8 v35.45,45.35 | R28.1 94.56,73.16 C61.2 | C30.2 R26.1
  Bot 0.254: C33.2 18.34,33.91
  Bot 0.305: R25.1 C29.2 8,52.4 v7.1,51.5
  Bot 0.406: v75.2,11.3 73.4,9.5 73.4,8.3 72.8,7.7 72.05,7.7 71,7.7 70.55,7.7 R34.1 C65.2 | R31.1 97.25,32.71 97.25,33.2 C63.2 97.03,33.95 v98.9,33.95 | 103.65,52.6 102.7,53.55 C62.2 101.25,52.6 R30.1 | C33.2 16.33,31.85 12.43,31.85 v12.04,31.45 | C61.2 100.3,73.15 v100.4,73.25 | R33.1 62.05,18.1 62,18.05
  Bot 0.61: C64.2 62,18.05 v63.05,18.05 | C1.1 59.35,72.35 | C30.2 17.8,81.7 v17.9,81.8
  Bot 0.813: IC7_XMEGA_AREF.5 59.35,72.35 59.35,74.05 59.75,74.45 69.5,74.45 70.4,74.45 v71.9,72.95 v72.85,72.95
AREF_EN  (via drill 0.3)
  Top 0.2: IC4.70 25.3,51.4 v25.7,51.8 | R57.2 60.65,67.85 v60.95,67.85
  POWER 0.2: v25.7,51.8 24.8,50.9 24.8,48.05 25.25,47.6 38.45,47.6 38.9,47.15 39.5,47.15 39.95,47.6 39.95,60.65 40.55,61.25 v47,61.25
  Bot 0.2: v47,61.25 47,62.9 48.5,64.4 59.6,64.4 60.35,65.15 60.35,68 60.58,68.23 | 60.58,68.23 61.1,68.75 61.95,68.75 IC7_XMEGA_AREF.3 | v60.95,67.85 60.58,68.23
  Bot 0.305: R165.2 63.35,68.4 63,68.75 62,68.75 IC7_XMEGA_AREF.3
ARM_RX_TX_SCL_SDA
  Top 0.3: 39.6,72.15 39.6,74.05 39.35,74.3 R12.2
  Top 0.305: Q18.3 39.6,70.7 39.6,72.15 40.05,72.15 R50.1
ARM_RX_TX_SCL_SDA_
  Top 0.3: R12.1 30.95,74.3 28.06,77.2 U$1.J2_20
ARM_TX_RX_SDA_SCL  (via drill 0.3)
  Top 0.2: R51.1 41.15,66.94 Q18.6 41.15,69.35 v41.3,69.5
  Top 0.3: v41.3,72.95 41.3,74.9 41,75.2 R13.2
  Bot 0.3: v41.3,69.5 v41.3,72.95
ARM_TX_RX_SDA_SCL_
  Top 0.3: R13.1 31.1,75.2 30.65,75.65 30.6,75.7 U$1.J2_18
ARM_UART_BT_ENABLE  (via drill 0.3)
  Top 0.2: R7.2 47.9,71.1 47.95,71.05 v47.95,70.5 | IC4.59 v25.55,56.9
  Top 0.254: v46.85,63.8 48.05,63.8 49.05,64.8 49.05,66.65
  Top 0.305: 49.7,71.3 49.7,70.95 49.45,70.7 v49.4,70.7 | v47.95,70.5 47.95,68.4 48.05,68.3 R77.2 | IC2.1 51,68.05 51.25,68.3 v51.45,68.3
  Top 0.45: IC2.1 51,66.75 50.9,66.65 49.05,66.65 48.7,67 R77.2 | IC3.1 49.7,71.3
  POWER 0.2: v25.55,56.9 24.95,56.9 24.35,57.5 24.35,58.7 23.75,59.3 22.25,59.3 20.15,59.3 19.4,60.05 19.4,62.6 20.15,63.35 22.85,63.35 23.15,63.05 38.9,63.05 39.8,62.15 40.7,62.15 41.75,63.2 v42.95,63.2
  Bot 0.254: v42.95,63.2 45.2,63.2 46.25,63.2 v46.85,63.8
  Bot 0.305: v49.4,70.7 48.15,70.7 v47.95,70.5
AVCC  (via drill 0.3)
  Top 0.25: IC4.4 41.05,50.4 41.3,50.15 41.6,50.15
  Top 0.305: v35.65,48.25 35.6,48.25 35.2,47.85 IC4.94 | IC4.4 39.25,50.4 v38.85,50.8
  Top 0.4: v47.75,46.7 44.35,50.1 44.3,50.15 43.4,50.15 41.6,50.15 | v52.7,46.7 53.6,46.7 54.35,45.95 59.75,45.95 | 59.75,45.95 65.15,45.95 65.3,46.1 69.95,46.1 v70.85,46.1 | v66.8,66.2 66.5,66.2 61.85,66.2 59.75,64.1 59.75,45.95
  Top 0.61: v35.65,48.25 v35.65,49.95 | v38.85,50.8 v37.15,50.8
  Bot 0.3: 71.75,48.5 71.81,48.56
  Bot 0.305: 35.65,49.1 C25.2 35.65,49.05
  Bot 0.4: v47.75,46.7 v52.7,46.7 | v70.85,46.1 70.85,47.6 71.75,48.5 | 71.81,48.56 R166.1 72.76,48.56 72.85,48.65 R15.1 | C7.1 66.8,71.09 | 66.8,71.09 v66.8,66.2 | R36.1 67.01,71.3 66.8,71.09
  Bot 0.406: R166.1 72.31,48.56
  Bot 0.6: C26.2 35.7,53.5 35.1,54.1 FERITE_BEAD.1
  Bot 0.61: 35.65,49.05 v35.65,48.25 v35.65,49.95 35.65,50.35 36.1,50.8 | C7.1 64.49,70.79 C4.1 63.15,70.7 IC7_XMEGA_AREF.1 | 36.1,50.8 v37.15,50.8 C31.2 v38.85,50.8 | 36.1,50.8 C26.2
BAT_CHARGE_ENABLE  (via drill 0.3)
  Top 0.2: v47,59.75 47.6,59.75 48.8,60.95 58.55,60.95 59.15,61.55 59.15,64.25 61.7,66.8 v71.6,66.8 71.6,67.4 71.3,67.7 R55.2 | RN3.5 v18.5,58.85
  POWER 0.2: v47,59.75 46.7,59.75 46.1,60.35 41.3,60.35 40.85,59.9 40.85,47.3 39.8,46.25 38.6,46.25 38.15,46.7 24.95,46.7 23.9,47.75 23.9,58.4 23.45,58.85 v18.5,58.85
  Bot 0.2: v71.6,66.8 71.9,66.8 72.21,66.49 R92.1 72.25,65.96 Q6.2
BAT_CHARGE_ENABLE-A
  Top 0.254: IC4.62 23.45,55.4 22.85,54.8 RN4.4
BAT_CHARGE_STAT_VOLTAGE  (via drill 0.3)
  Top 0.2: IC4.12 43.9,54.4 v44.15,54.65
  Bot 0.2: v44.15,54.65 44.3,54.8 44.3,55.25 44.3,58.4 45.05,59.15 47.3,59.15 48.05,59.9 48.05,63.2 48.8,63.95 62.15,63.95 62.45,63.95 67.85,63.95 68.3,64.4 68.3,70.25 68.45,70.4 D1.A
  Bot 0.406: R135.2 R36.2 D1.A 69.91,70.4 R38.1
BATTERY  (via drill 0.3)
  Top 0.2: v67.85,36.5 67.85,35.45 68.75,34.55 68.75,20.6 69.2,20.15 71.9,17.45 71.9,13.7 73.7,11.9 R154.2
  POWER 0.2: v69.95,38.75 67.85,36.65 v67.85,36.5
  Bot 0.2: R18.1 v69.95,38.75
  Bot 0.406: 74.05,39.4 R155.1 | Q1.2 69.48,39.73 69.6,39.85 69.7,39.95 | 70.45,40.2 71.45,39.2 | R18.1 v69.95,38.75 | R161.2 69.3,42.6 69.35,42.65
  Bot 0.52: R156.2 74.2,40.45 74.35,40.3 R155.1
  Bot 0.61: IC13.3 75.86,69.54 75.35,70.05 C6.1 73.5,70.05 71.9,68.45 R32.2 | R32.2 | R32.2 70.01,67.66 69.05,66.7 69.05,62.3 71.7,59.65 71.7,58 C14.1
  Bot 1.778: L14.1 76.1,51.65 72.9,51.65 69.35,48.1 69.35,42.65 69.35,41.85 69.35,39.85 69.6,39.85
  pour Bot (no thermals): 66.7,38.85 72.8,38.85 73.15,38.5 75.15,38.5 75.15,40.95 66.7,40.95
  pour Bot (no thermals): 77.45,59.2 77.45,51.95 70.95,51.95 70.95,59.2
  pour Bot (rank 2, no thermals): 77.6,60.55 77.6,60.35 76.55,59.3 76.55,51.85 77.85,51.85 77.85,60.55
BATTERY_BEHIND_SWITCH
  Bot 0.406: 77.45,39.4 R155.2 77.2,39.65
  Bot 0.52: R155.2 77.6,40.15 R157.2
  pour Bot (no thermals): 81.85,38.5 76.35,38.5 76.35,40.9 81.85,40.9
BATTERY_CONNECTOR
  pour Bot (no thermals): 88.25,39.05 88.25,41.7 94.4,41.7 94.4,39.05
BATTERY_REVERSE_PROTECTED
  Top 0.61: BTN_PWR.P$4 80.8,18.52 PWR_PINS.2
  Bot 0.2: R152.2 85.21,35.34 86.45,34.1 86.45,26.75 85.7,26 85.7,22.25 83.9,20.45 PWR_PINS.2
  Bot 0.305: Q17.2 Q17.3
  Bot 0.406: 85.51,39.82 Q17.2 | Q17.1 85.58,39.1 85.75,39.1 85.7,39.05 85.7,38.45 R152.2
  pour Bot (no thermals): 85.95,39.15 82.5,39.15 82.5,40.9 85.95,40.9
BT_COM_VOLTAGE
  Top 0.2: R5.2 41.6,87.35 41.23,86.97
  Top 0.4: 56.9,76.1 52.95,80.05 52.95,85.05 51.75,86.25 41.95,86.25 41.23,86.97 40.85,87.35 JP1.2
  Top 0.406: 56.8,70.66 R74.2 | R74.2 R73.2 57.29,71.39 57.5,71.6 57.5,75.5 56.9,76.1 | R74.2
BTN_A  (via drill 0.3)
  Top 0.2: v40.25,7.55 39.8,7.55 arc-12 32.3,9.95 31.75,10.5 31.75,26.35 31.35,26.75 RN8.8 | R44.2 82.55,12.83 BTN_A.P$2
  GND 0.2: v40.25,7.55 49.55,7.55 50.45,6.65 60.35,6.65 62,5 62,4.1 62.6,3.5 63.2,3.5 arc23 82.85,10.4 83.36,10.91 BTN_A.P$2
  Bot 0.2: C69.2 84.11,12.02 BTN_A.P$2
BTN_A_
  Top 0.2: IC4.88 32.2,45.55 30.8,44.15 30.8,42.8 30.8,39.95 31.35,39.4 RN8.1
BTN_B  (via drill 0.3)
  Top 0.2: v40.7,6.8 39.65,6.8 arc-12 31.4,9.8 30.65,10.55 30.65,23.15 31.35,23.85 31.35,26.2 30.55,27 RN8.7 | R42.2 97.85,40.4 v97.7,40.25
  GND 0.2: BTN_B.P$2 105.2,37.51 105.2,36.65 arc-61 63.2,2.75 61.85,2.75 61.4,3.2 61.4,4.85 60.05,6.2 50.15,6.2 49.55,6.8 v40.7,6.8
  Bot 0.2: C68.2 104.9,39.48 BTN_B.P$2 99.31,38.64 v97.7,40.25
BTN_B_
  Top 0.2: IC4.87 31.7,45.65 30.35,44.3 30.35,39.65 30.55,39.45 RN8.2
BTN_C  (via drill 0.3)
  Top 0.2: v41.3,6.05 39.5,6.05 arc-12 30.5,9.65 29.84,10.31 29.84,22.94 30.95,24.05 30.95,26 29.75,27.2 RN8.6 | R41.2 99.05,71.45 v98.15,72.35
  GND 0.2: BTN_C.P$2 105.96,71.29 106.85,70.4 arc-98 63.2,2 61.25,2 60.8,2.45 60.8,4.7 59.75,5.75 49.85,5.75 49.55,6.05 v41.3,6.05
  Bot 0.2: C67.2 104.9,70.58 BTN_C.P$2 103.13,72.35 v98.15,72.35
BTN_C_
  Top 0.2: IC4.86 31.2,45.75 29.9,44.45 29.9,39.65 29.75,39.5 RN8.3
BTN_D  (via drill 0.3)
  Top 0.2: v41.75,5.3 39.35,5.3 arc-12 29.6,9.5 28.85,10.25 28.85,22.55 30.5,24.2 30.5,25.85 28.95,27.4 RN8.5 | R40.2 v80.3,95 | v80.3,95
  GND 0.2: BTN_D.P$2 84.77,99.8 85.85,99.8 arc-137 63.2,1.25 60.95,1.25 60.2,2 60.2,4.55 59.45,5.3 v41.75,5.3
  Bot 0.2: C66.2 83.38,97.56 BTN_D.P$2 83.38,98.38 80.3,95.3 v80.3,95
BTN_D_
  Top 0.2: IC4.85 30.7,45.85 29.45,44.6 29.45,39.8 28.95,39.3 RN8.4
BTN_PWR_
  Top 0.2: PWR_PINS.1 76.33,22.33 76.55,22.55 77.15,23.15 83.3,23.15 83.75,23.6 Q10.2
  Top 0.406: R3.2 R11.2 83.75,26.84 Q10.5 Q10.2
  Top 0.61: BTN_PWR.P$2 74.37,18.49 PWR_PINS.1
BUMPER_BACK_LEFT_A  (via drill 0.3)
  Top 0.2: U$3.15 35.65,89.95 38.3,92.6 77.45,92.6 78.2,93.35 78.2,95 79.7,96.5 85.55,96.5 v85.85,96.8
  POWER 0.2: SENSOR_BACK_LEFT.1 96,20 96.35,20.35 arc40 109.05,54.92 arc51 89.68,96.27 89.45,96.5 86.15,96.5 v85.85,96.8
BUMPER_BACK_LEFT_B  (via drill 0.3)
  Top 0.2: U$3.16 35.55,90.45 38.1,93 77.25,93 77.75,93.5 77.75,95.15 79.55,96.95 84.95,96.95 85.4,97.4 86.45,97.4 v86.75,97.1
  POWER 0.2: SENSOR_BACK_LEFT.2 90.9,17.2 93.95,17.2 arc47 109.45,54.91 arc51 89.74,96.81 89.45,97.1 v86.75,97.1
BUMPER_BACK_RIGHT_A
  Top 0.2: SENSOR_BACK_RIGHT.1 89.95,94.8 89.15,95.6 80,95.6 79.1,94.7 79.1,93.05 77.75,91.7 38.6,91.7 35.85,88.95 U$3.13
BUMPER_BACK_RIGHT_B
  Top 0.2: SENSOR_BACK_RIGHT.2 91.75,93.6 89.3,96.05 79.85,96.05 78.65,94.85 78.65,93.2 77.6,92.15 38.45,92.15 35.75,89.45 U$3.14
BUMPER_FRONT_LEFT_A  (via drill 0.3)
  Top 0.2: U$3.11 33.5,84.65 31.85,83 13.1,83 v13.05,83.05
  POWER 0.2: v13.05,83.05 8.5,83.05 8.15,82.7 arc20 1.4,64.25 1.4,63.65 2,63.05 4.4,63.05 4.85,62.6 4.85,60.35 4.4,59.9 4.4,52.25 3.5,51.35 1.7,51.35 0.95,50.6 0.95,48.65 arc37 15.8,17.3 16.25,16.85 18.65,16.85 SENSOR_FRONT_LEFT.1
BUMPER_FRONT_LEFT_B  (via drill 0.3)
  Top 0.2: U$3.12 34,84.55 32,82.55 13.75,82.55 13.5,82.3 v12.5,82.3
  POWER 0.2: v12.5,82.3 8.65,82.3 8.3,81.95 arc20 1.85,64.4 1.85,64.1 2.45,63.5 4.55,63.5 5.3,62.75 5.3,60.2 4.85,59.75 4.85,52.1 3.65,50.9 2,50.9 1.4,50.3 1.4,48.95 arc36 15.05,18.8 17,18.8 SENSOR_FRONT_LEFT.2
BUMPER_FRONT_RIGHT_A
  Top 0.2: U$3.9 32.5,87.1 32.3,86.9 27.35,86.9 26.75,87.5 26.75,91.1 26.3,91.55 20.15,91.55 SENSOR_FRONT_RIGHT.2
BUMPER_FRONT_RIGHT_B
  Top 0.2: U$3.10 33,86.85 32.6,86.45 27.2,86.45 26.3,87.35 26.3,89.3 25.85,89.75 18.35,89.75 SENSOR_FRONT_RIGHT.1
DEBUG_RX  (via drill 0.3)
  Top 0.2: JP3.P$4 2.6,56.3 2.61,56.29 6.34,56.29 v6.95,56.9 | v7.4,63.2 8.45,64.25 RN5.5
  GND 0.2: v6.95,56.9 7.1,57.05 7.1,60.65 7.4,60.95 v7.4,63.2
DEBUG_RX_
  Top 0.2: IC4.27 37.7,65.75 34.5,68.95 19,68.95 14.3,64.25 RN5.4
DEBUG_TX  (via drill 0.3)
  Top 0.2: v6.8,61.25 9,63.45 RN5.6
  Bot 0.2: JP3.P$3 3.8,56.3 6.8,59.3 v6.8,61.25
DEBUG_TX_
  Top 0.2: IC4.28 37.2,65.65 34.25,68.6 19.25,68.6 14.1,63.45 RN5.3
DISPLAY_BACKLIGHT-EN
  Top 0.254: IC4.65 22.85,53.9 22.7,54.05 22.15,54.05 RN4.3
DISPLAY_BACKLIGHT_EN  (via drill 0.3)
  Top 0.2: Q14.1 89.45,44.9 | v55.1,42.35 84.65,42.35 85.4,42.35 87.65,44.6 87.76,44.71 R159.2 | RN3.8 v19.1,56.45
  Top 0.61: Q14.1 89.31,44.71 R159.2
  POWER 0.2: v55.1,42.35 39.35,42.35 37.55,42.35 34.1,45.8 24.65,45.8 23,47.45 23,56 22.55,56.45 v19.1,56.45
DISPLAY_BACKLIGHT_SW_GND
  Top 0.2: R4.2 89.75,45.95 90.35,45.35 90.35,44.45 90.5,44.3 90.6,44.2 Q14.3
  Top 0.4: Q14.3 93.91,44.2 DISPLAY_OUTPUT_BACKLIGHT.16
DISPLAY_BACKLIGHT_VCC
  Bot 0.61: DISPLAY_OUTPUT_BACKLIGHT.15 91.73,46.06 R138.1
DISPLAY_DB4
  Top 0.2: DISPLAY_INPUT.11 65.54,60.05 69.95,60.05 73.85,56.15 81.05,56.15 82.85,54.35 92.75,54.35 93.2,53.9 93.2,51.17 DISPLAY_OUTPUT_BACKLIGHT.11
DISPLAY_DB5
  Top 0.2: DISPLAY_INPUT.12 64.2,61.25 69.5,61.25 74.15,56.6 81.2,56.6 83,54.8 93.05,54.8 95.75,52.1 95.75,51.16 DISPLAY_OUTPUT_BACKLIGHT.12
DISPLAY_DB6
  Top 0.2: DISPLAY_INPUT.13 68.93,62.57 74.45,57.05 81.35,57.05 83.15,55.25 89.15,55.25 89.3,55.25 93.5,55.25 96.95,51.8 96.95,50.45 96.35,49.85 94.48,49.85 DISPLAY_OUTPUT_BACKLIGHT.13
DISPLAY_DB7
  Top 0.2: DISPLAY_INPUT.14 64.21,63.8 68.45,63.8 74.75,57.5 81.65,57.5 82.4,56.75 83.45,55.7 93.8,55.7 97.4,52.1 97.4,50.23 DISPLAY_OUTPUT_BACKLIGHT.14
DISPLAY_E
  Top 0.2: DISPLAY_INPUT.6 61.25,54.14 61.25,63.65 62.3,64.7 71.6,64.7 75.5,60.8 91.85,60.8 92.6,60.05 94.48,60.05 DISPLAY_OUTPUT_BACKLIGHT.6
DISPLAY_R!W
  Top 0.2: DISPLAY_INPUT.5 61.7,56.23 61.7,63.5 62.45,64.25 71.45,64.25 75.35,60.35 91.64,60.35 DISPLAY_OUTPUT_BACKLIGHT.5
DISPLAY_RS
  Top 0.2: DISPLAY_INPUT.4 62.73,49.87 60.35,52.25 60.35,63.95 62,65.6 72.2,65.6 76.1,61.7 91.7,61.7 92.45,62.45 94.62,62.45 DISPLAY_OUTPUT_BACKLIGHT.4
DISPLAY_V0
  Top 0.2: DISPLAY_INPUT.3 64.34,51.05 62.3,51.05 60.8,52.55 60.8,63.8 62.15,65.15 71.9,65.15 75.8,61.25 93.18,61.25 DISPLAY_OUTPUT_BACKLIGHT.3
ENCODER_LEFT_A  (via drill 0.3)
  Top 0.2: 8.98,57.88 6.95,55.85 6.95,54.8 5.75,53.6 5.75,51.2 v6.2,50.75 | 8.98,57.88 9.05,57.95 | 8.98,57.88 9.05,57.95 | 9.05,57.95 RN6.8
  GND 0.15: 48.15,3.35 48.35,3.35 49.1,4.1 51.13,4.1 ENCODER_LEFT.7
  GND 0.2: 48.15,3.35 arc-75 3.33,48.31 3.33,48.78 3.65,49.1 5.6,49.1 6.2,49.7 v6.2,50.75
ENCODER_LEFT_A_
  Top 0.2: IC4.29 36.7,65.6 34.05,68.25 19.65,68.25 14.05,62.65 RN5.2
ENCODER_LEFT_B  (via drill 0.3)
  Top 0.2: v6.35,53.3 7.4,54.35 7.4,55.7 8.95,57.25 12.45,57.25 13.3,56.4 RN7.6
  GND 0.15: 48.16,2.89 48.64,2.89 49.25,3.5 50,3.5 50.4,3.1 52.67,3.1 ENCODER_LEFT.5
  GND 0.2: 48.16,2.89 arc-76 2.82,48.75 2.82,49.32 3.05,49.55 4.1,49.55 6.35,51.8 v6.35,53.3
ENCODER_LEFT_B_
  Top 0.2: IC4.30 36.2,65.5 33.85,67.85 20,67.85 14,61.85 RN5.1
ENCODER_RIGHT_A  (via drill 0.3)
  Top 0.2: v4.25,60.65 7.25,60.65 9.25,62.65 RN5.7
  GND 0.15: ENCODER_RIGHT.7 57.47,104.6 50.6,104.6 49.85,105.35 49.85,106.1 49.23,106.72 48.73,106.72
  GND 0.2: 48.73,106.72 arc76 3.43,61.58 4.25,60.76 v4.25,60.65
ENCODER_RIGHT_A_
  Top 0.2: IC4.49 26.7,64 25.85,64.85 20,64.85 13.1,57.95 RN6.1
ENCODER_RIGHT_B  (via drill 0.3)
  Top 0.2: v3.2,60.65 3.8,60.05 7.4,60.05 9.2,61.85 RN5.8
  GND 0.15: ENCODER_RIGHT.5 55.23,104.9 50.75,104.9 50.15,105.5 50.15,106.25 49.23,107.17 48.72,107.17
  GND 0.2: 48.72,107.17 arc76 2.86,61.15 2.86,60.99 v3.2,60.65
ENCODER_RIGHT_B_
  Top 0.2: IC4.50 26.2,63.75 25.55,64.4 20.3,64.4 16.25,60.35 16.25,56.75 16.6,56.4 RN7.3
ENCODER_SPI_CLK  (via drill 0.3)
  Top 0.2: v0.94,58.86 1.1,58.7 | v0.94,58.86 1.25,58.55 8.15,58.55 8.35,58.75 RN6.7 | v0.94,58.86 0.94,59.9 0.95,59.91 0.95,60.95 2.75,62.75 5.3,62.75 8.4,65.85 U$4.23
  GND 0.15: ENCODER_RIGHT.2 50.46,109.11 49.41,109.11 arc78 0.94,61.15 | ENCODER_LEFT.2 57.69,0.5 50.3,0.5 49.78,1.02
  GND 0.2: 49.78,1.02 48.89,1.02 arc-77 0.95,48.75 0.95,50.6 1.7,51.35 3.5,51.35 4.4,52.25 4.4,53.6 3.5,54.5 3.5,58.1 3.05,58.55 1.25,58.55 v0.94,58.86 0.94,61.15
ENCODER_SPI_CLK_
  Top 0.2: IC4.42 30.2,66.35 29.9,66.65 21.05,66.65 13.15,58.75 RN6.2
ENCODER_SPI_CS-N_L  (via drill 0.3)
  Top 0.15: v49.55,2.9 49.81,2.9 ENCODER_LEFT.8
  Top 0.2: v13.55,55.55 15.3,55.55 RN7.7
  GND 0.15: 48.88,2.35 49,2.35 v49.55,2.9
  GND 0.2: v13.55,55.55 13.55,56.75 13.1,57.2 8.9,57.2 5.75,54.05 5.75,51.8 3.95,50 2.6,50 2.36,49.76 2.36,48.75 arc77 48.88,2.35
ENCODER_SPI_CS-N_L_
  Top 0.2: 18.05,53.9 18.05,53.45 | 18.05,53.9 18.05,55.4 17.9,55.55 17.2,55.55 RN7.2 | 18.05,53.9 18.05,52.85 20,50.9 IC4.71
ENCODER_SPI_CS-N_R  (via drill 0.3)
  Top 0.2: 14.3,54.8 v14.15,54.8 RN7.8
  GND 0.15: 49.18,107.67 50,106.85 58.25,106.85 58.76,107.36 ENCODER_RIGHT.8
  GND 0.2: 49.18,107.67 48.75,107.67 arc76 2.36,61.15 2.36,60.59 2.9,60.05 3.35,60.05 4.85,58.55 4.85,55.7 5.45,55.1 6.2,55.1 8.75,57.65 13.4,57.65 14.15,56.9 v14.15,54.8
ENCODER_SPI_CS-N_R_
  Top 0.2: RN7.1 17.15,53.15 19.9,50.4 IC4.72
ENCODER_SPI_MISO  (via drill 0.3)
  Top 0.2: U$4.9 8,72.05 9.05,73.1 v9.05,74.15 | v4.1,62 2.75,62 1.7,60.95 v1.7,59.15 1.85,59 7.85,59 8.4,59.55 RN6.6
  GND 0.15: ENCODER_RIGHT.4 52.7,107.45 50.6,107.45 49.46,108.59 | ENCODER_LEFT.4 55.24,2.55 50.7,2.55 49.6,1.45 49.59,1.44 49.49,1.44
  GND 0.2: 49.46,108.59 48.75,108.59 arc77 1.4,61.15 1.4,59.45 v1.7,59.15 1.85,59 3.2,59 3.95,58.25 3.95,54.65 4.85,53.75 4.85,52.1 3.65,50.9 2,50.9 1.4,50.3 1.4,48.76 1.41,48.75 arc77 48.89,1.44 49.49,1.44 | v9.05,74.15 7.5,74.15 6.9,73.55 arc10 3.95,62.3 3.95,62.15 v4.1,62
ENCODER_SPI_MISO_
  Top 0.2: IC4.41 30.7,66.6 30.2,67.1 20.75,67.1 13.2,59.55 RN6.3
ENCODER_SPI_MOSI  (via drill 0.3)
  Top 0.15: v49.4,2 49.4,1.4 50.3,0.5 52.61,0.5 ENCODER_LEFT.6
  Top 0.2: U$4.24 8.8,65.65 4.55,61.4 2.9,61.4 2.45,60.95 v2.45,59.6 7.7,59.6 8.45,60.35 RN6.5
  GND 0.15: 49.31,108.14 50.3,107.15 54.94,107.15 ENCODER_RIGHT.6 | 48.88,1.85 49.25,1.85 v49.4,2
  GND 0.2: 49.31,108.14 48.75,108.14 arc77 1.89,61.15 1.89,60.01 2.3,59.6 v2.45,59.6 3.2,59.6 4.4,58.4 4.4,54.8 5.3,53.9 5.3,51.95 3.8,50.45 2.2,50.45 1.9,50.15 1.9,48.76 1.91,48.75 arc77 48.88,1.85
ENCODER_SPI_MOSI_
  Top 0.2: IC4.40 31.2,66.7 30.4,67.5 20.4,67.5 13.25,60.35 RN6.4
GND  (via drill 0.3)
  Top 0.2: IC1.3 | U$4.18 5.8,68.5 5.45,68.85 C59.1 | U$4.20 7.2,67.5 6.95,67.25 v5.9,67.25 | v4.4,45.95 2,45.95 1.55,46.4 1.55,46.97 LED4.C | LED2.C 6.8,78.46 6.8,76.25 7.1,75.95 v8,75.95 C57.1 | LED25.C 46.85,108.5 46.55,108.2 46.55,104.6 47,104.15 50.75,104.15 51.14,104.54 | v9.95,32.45 9.05,31.55 7.15,31.55 LED10.C | C58.2 v10.1,75.95 | LED12.C 45.05,1.7 44.6,2.15 44.6,4.4 v44.75,4.55 | LED16.C 108.35,62.44 BTN_C.P$4 | LED14.C 102.99,33.39 v103.25,33.65 | LED18.C 102.21,79.7 v101.45,79.7 | IC5.1 50.45,54.05 50.55,53.95 51.5,53.95 | 51.5,53.95 51.65,53.95 51.75,54.05 IC5.3 | R98.2 53.61,47.35 3PI_CONNECTOR.13 | IC1.1 51.39,53.95 51.5,53.95 | R48.1 50.45,23.15 50.05,22.75 C37.2 | LED29.C 46.85,87.35 47.3,87.8 47.38,87.88 BLUETOOTH_CONNECTOR_TOP.2 | LED33.C 18.35,69.2 18.95,69.8 19,69.85 R9.1 | v27.5,87.95 27.5,90.95 26.3,92.15 24.8,92.15 24.35,92.6 24.35,98.75 24.8,99.2 LED35.C | LED42.C 58.25,59.9 58.7,59.45 58.7,56.75 58.25,56.3 55.1,56.3 54.35,57.05 Q8.2 | LED54.C 83.6,35.9 83.3,35.6 79.25,35.6 v78.65,35 | LED39.C 49.1,28.1 49.85,28.85 49.91,28.91 U$1.J3_12 | LED30.C v73.7,6.95 | LED51.C 75.15,58.45 v83.95,58.45 | LED32.C v73.7,103.55 | LED37.C 24.5,10.7 24.05,11.15 v24.05,14.45 | LED50.C 65.3,67.7 v65.15,67.85 | LED52.C 57.2,64.37 v57.2,62.45
  Top 0.25: IC4.3 39.3,49.9 v38.9,49.5 | IC4.93 34.7,47.8 v34.25,48.25
  Top 0.254: 26.45,69.65 v26.6,69.65
  Top 0.3: IC4.43 29.7,65.15 v28.95,65.9 v28.15,65.9 | U$3.4 32.5,91.75 v31.35,92.9
  Top 0.305: 20.05,71.45 Q3.2 | IC4.73 25.15,49.9 v25.55,50.3 v27.25,50.3 | v35.1,59.85 v35.1,61.55 34.7,61.95 IC4.33 | v27.75,60.3 v26.05,60.3 25.65,59.9 IC4.53 | v27.25,55.3 v25.55,55.3 25.15,54.9 IC4.63 | v30.6,49.95 v30.6,48.25 30.2,47.85 IC4.84 | v30.1,59.35 v30.1,61.05 29.7,61.45 IC4.43 | v37.1,54.5 v38.85,54.5 39.25,54.9 IC4.13 | v37.15,59.5 v38.85,59.5 39.25,59.9 IC4.23 | U$3.8 31.33,88.95 31.13,88.75 31.13,88.3 30.98,88.15 C46.2 | C24.2 35.85,42.75 Q2.GND$2 33.9,41.8 33.9,40.75 33.5,40.35 Q2.GND$1 v32.95,39.1 | 32,40.35 C28.2 | JP3.P$6 6.17,57.57 v6.45,57.85 | LED26.C 73.29,70.26 72.9,70.65 v72,70.65 | v26.6,69.65 25.25,71 C8.2
  Top 0.4: v48.2,55.1 48.25,55.05 C41.1 49.75,55.05 50.1,54.7 IC5.1 | v53.6,52.25 53.55,52.3 C40.1 52.29,52.66